# EAGLE schematic raceCapture (EAGLE 5.09)

## Sheet 1 of 5
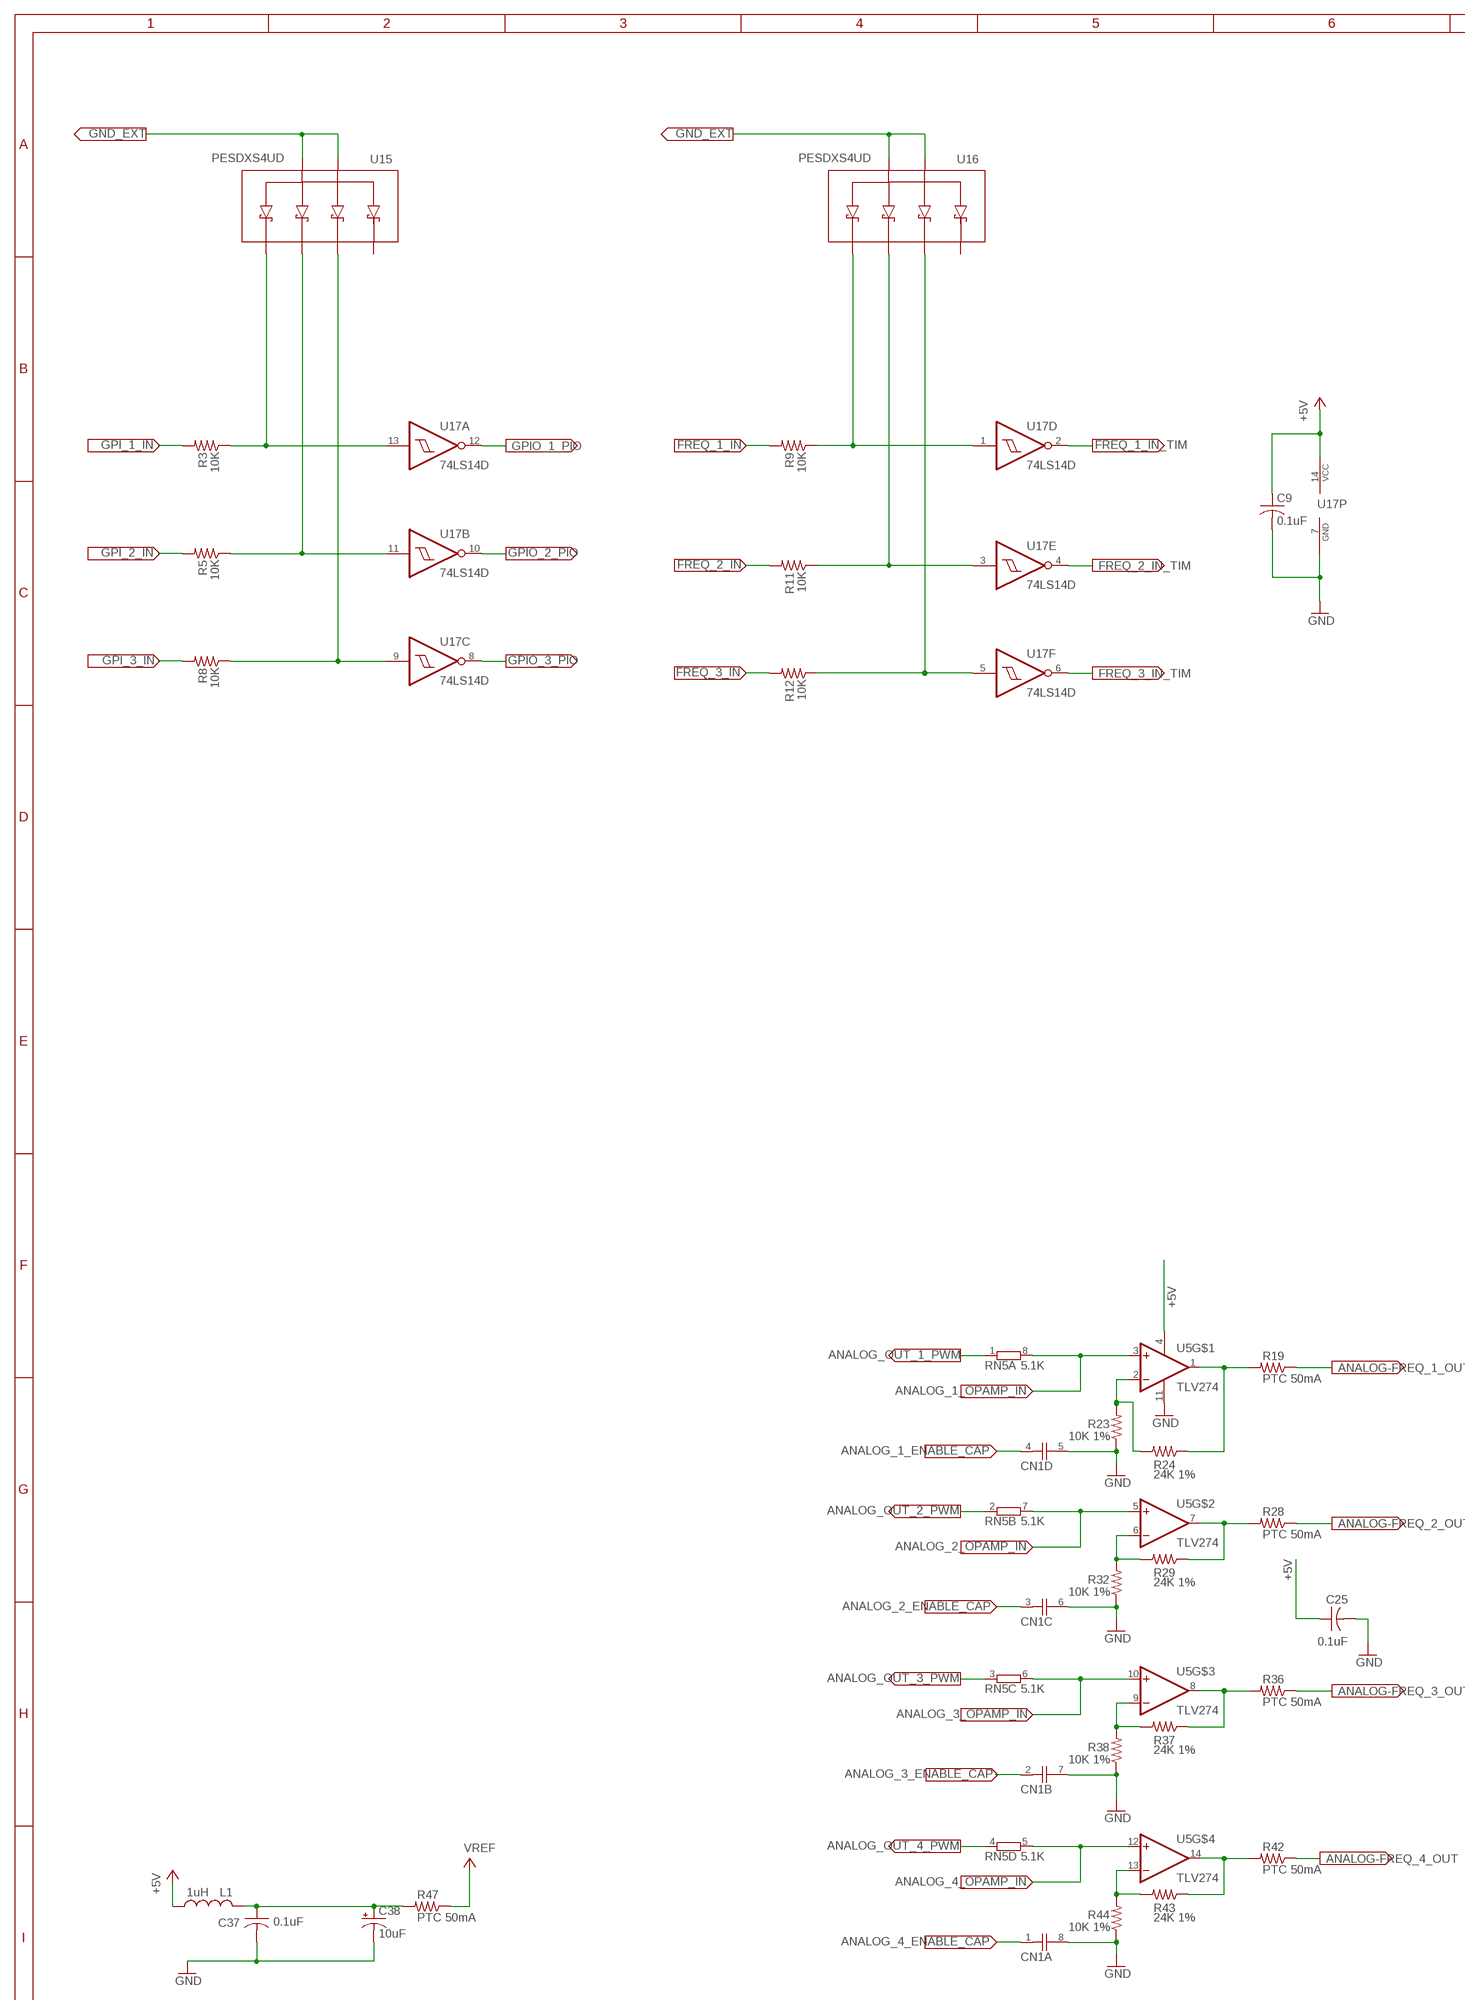
[diagram p0: schematic, sheet 1, part 1 of 2]
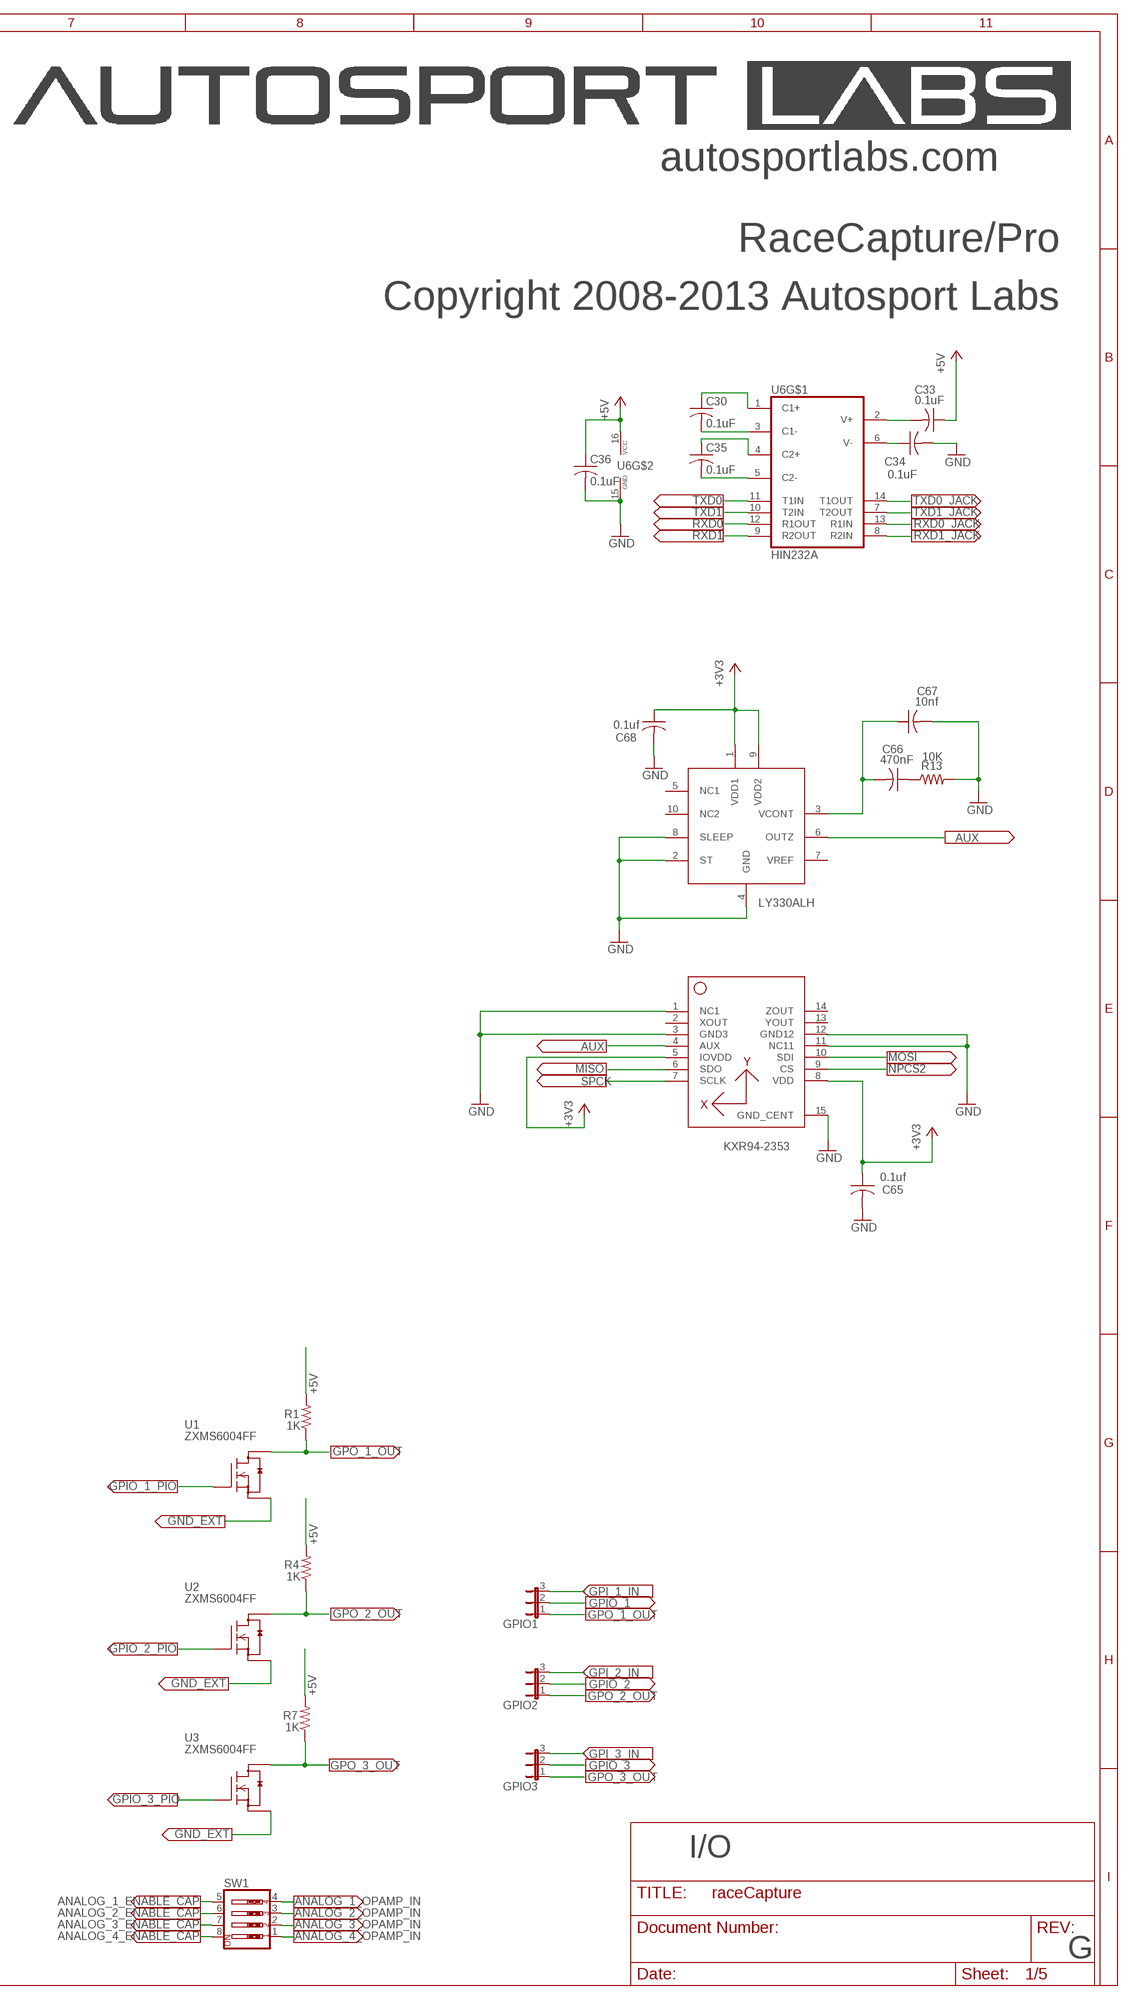
[diagram p1: schematic, sheet 1, part 2 of 2]

### Parts
C9  0.1uF  C-USC0603  [C0603]
C25  0.1uF  C-USC0603  [C0603]
C30  0.1uF  C-USC0603  [C0603]
C33  0.1uF  C-USC0603  [C0603]
C34  0.1uF  C-USC0603  [C0603]
C35  0.1uF  C-USC0603  [C0603]
C36  0.1uF  C-USC0603  [C0603]
C37  0.1uF  C-USC0603  [C0603]
C38  10uF  CPOL-USSMCA  [SMC_A]
C65  0.1uf  C-USC0603K  [C0603K]
C66  470nF  C-USC0603K  [C0603K]
C67  10nf  C-USC0603K  [C0603K]
C68  0.1uf  C-USC0603K  [C0603K]
CN1  CAP_ARRAY_41206_ARRAY  [1206_ARRAY]
GPIO1  JP2E  [JP2]
GPIO2  JP2E  [JP2]
GPIO3  JP2E  [JP2]
L1  1uH  INDUCTOR  [1210]
R1  1K  R-US_R1206  [R1206]
R3  10K  R-US_R1206  [R1206]
R4  1K  R-US_R1206  [R1206]
R5  10K  R-US_R1206  [R1206]
R7  1K  R-US_R1206  [R1206]
R8  10K  R-US_R1206  [R1206]
R9  10K  R-US_R1206  [R1206]
R11  10K  R-US_R1206  [R1206]
R12  10K  R-US_R1206  [R1206]
R13  10K  R-US_R0603  [R0603]
R19  PTC 50mA  R-US_R1206  [R1206]
R23  10K 1%  R-US_R0603  [R0603]
R24  24K 1%  R-US_R0603  [R0603]
R28  PTC 50mA  R-US_R1206  [R1206]
R29  24K 1%  R-US_R0603  [R0603]
R32  10K 1%  R-US_R0603  [R0603]
R36  PTC 50mA  R-US_R1206  [R1206]
R37  24K 1%  R-US_R0603  [R0603]
R38  10K 1%  R-US_R0603  [R0603]
R42  PTC 50mA  R-US_R1206  [R1206]
R43  24K 1%  R-US_R0603  [R0603]
R44  10K 1%  R-US_R0603  [R0603]
R47  PTC 50mA  R-US_R1206  [R1206]
RN5  5.1K  4R-N0603-ARC  [0603-ARC]
SW1  SW_DIP-4  [EDG-04]
U1  ZXMS6004FF  [SOT-23]
U2  ZXMS6004FF  [SOT-23]
U3  ZXMS6004FF  [SOT-23]
U4  KXR94-2353  KXR94  [5X5_DFN]
U5  TLV274  TLV274SO14  [SO14]
U6  HIN232A  [SOIC-16]
U10  LY330ALH  [LGA-10]
U15  PESDXS4UD  [SC-74]
U16  PESDXS4UD  [SC-74]
U17  74LS14D  [SO14]

### Nets
+3.3V: U4.5(IOVDD) ; supply symbol labelled +3V3
+5V: C9.1 C25.1 C33.1 C36.1 L1.1 R1.2 R4.2 R7.2 U5.4(V+) U6.16(VCC) U17.14(P:VCC) ; also sheet 2,3,4,5
ANALOG-FREQ_1_OPAMP_OUT: R19.2 R24.1 U5.1(OUT)
ANALOG-FREQ_1_OUT: R19.1 ; also sheet 5
ANALOG-FREQ_2_OPAMP_OUT: R28.2 R29.1 U5.7(OUT)
ANALOG-FREQ_2_OUT: R28.1 ; also sheet 5
ANALOG-FREQ_3_OPAMP_OUT: R36.2 R37.1 U5.8(OUT)
ANALOG-FREQ_3_OUT: R36.1 ; also sheet 5
ANALOG-FREQ_4_OPAMP_OUT: R42.2 R43.1 U5.14(OUT)
ANALOG-FREQ_4_OUT: R42.1 ; also sheet 5
ANALOG_1_ENABLE_CAP: CN1.4 SW1.5
ANALOG_1_OPAMP_IN: RN5.8 SW1.4 U5.3(+IN)
ANALOG_2_ENABLE_CAP: CN1.3 SW1.6
ANALOG_2_OPAMP_IN: RN5.7 SW1.3 U5.5(+IN)
ANALOG_3_ENABLE_CAP: CN1.2 SW1.7
ANALOG_3_OPAMP_IN: RN5.6 SW1.2 U5.10(+IN)
ANALOG_4_ENABLE_CAP: CN1.1 SW1.8
ANALOG_4_OPAMP_IN: RN5.5 SW1.1 U5.12(+IN)
ANALOG_OUT_1_PWM: RN5.1 ; also sheet 3
ANALOG_OUT_2_PWM: RN5.2 ; also sheet 3
ANALOG_OUT_3_PWM: RN5.3 ; also sheet 3
ANALOG_OUT_4_PWM: RN5.4 ; also sheet 3
AUX: U4.4(AUX) U10.6(OUTZ)
FREQ_1_IN: R9.2 ; also sheet 5
FREQ_1_IN_TIM: U17.2(D:O) ; also sheet 3
FREQ_2_IN: R11.2 ; also sheet 5
FREQ_2_IN_TIM: U17.4(E:O) ; also sheet 3
FREQ_3_IN: R12.2 ; also sheet 5
FREQ_3_IN_TIM: U17.6(F:O) ; also sheet 3
GND: C9.2 C25.2 C34.2 C36.2 C37.2 C38.- C65.2 C67.2 C68.2 CN1.5 CN1.6 CN1.7 CN1.8 R13.2 R23.1 R32.1 R38.1 R44.1 U4.1(NC1) U4.3(GND3) U4.11(NC11) U4.12(GND12) U4.15(GND_CENT) U5.11(V-) U6.15(GND) U10.2(ST) U10.4(GND) U10.8(SLEEP) U17.7(P:GND) ; also sheet 2,3,4,5
GND_EXT: U1.2(S1) U2.2(S1) U3.2(S1) U15.2 U15.5 U16.2 U16.5 ; also sheet 2,5
GPI_1_IN: GPIO1.3 R3.2
GPI_2_IN: GPIO2.3 R5.2
GPI_3_IN: GPIO3.3 R8.2
GPIO_1: GPIO1.2 ; also sheet 5
GPIO_1_PIO: U1.1(G) U17.12(A:O) ; also sheet 3
GPIO_2: GPIO2.2 ; also sheet 5
GPIO_2_PIO: U2.1(G) U17.10(B:O) ; also sheet 3
GPIO_3: GPIO3.2 ; also sheet 5
GPIO_3_PIO: U3.1(G) U17.8(C:O) ; also sheet 3
GPO_1_OUT: GPIO1.1 R1.1 U1.3(D1)
GPO_2_OUT: GPIO2.1 R4.1 U2.3(D1)
GPO_3_OUT: GPIO3.1 R7.1 U3.3(D1)
MISO: U4.6(SDO) ; also sheet 3,5
MOSI: U4.10(SDI) ; also sheet 3,5
N$1: C66.1 R13.1
N$3: C66.2 C67.1 U10.3(VCONT)
N$5: R3.1 U15.6 U17.13(A:I)
N$8: R29.2 R32.2 U5.6(-IN)
N$10: R23.2 R24.2 U5.2(-IN)
N$12: R37.2 R38.2 U5.9(-IN)
N$13: R5.1 U15.4 U17.11(B:I)
N$14: R43.2 R44.2 U5.13(-IN)
N$15: R8.1 U15.3 U17.9(C:I)
N$16: C30.1 U6.1(C1+)
N$17: C30.2 U6.3(C1-)
N$18: C35.1 U6.4(C2+)
N$19: C35.2 U6.5(C2-)
N$20: C33.2 U6.2(V+)
N$21: C34.1 U6.6(V-)
N$25: R9.1 U16.6 U17.1(D:I)
N$26: R11.1 U16.4 U17.3(E:I)
N$29: R12.1 U16.3 U17.5(F:I)
NPCS2: U4.9(CS) ; also sheet 3
RXD0: U6.12(R1OUT) ; also sheet 3
RXD0_JACK: U6.13(R1IN) ; also sheet 5
RXD1: U6.9(R2OUT) ; also sheet 3
RXD1_JACK: U6.8(R2IN) ; also sheet 5
SPCK: U4.7(SCLK) ; also sheet 3,5
TXD0: U6.11(T1IN) ; also sheet 3
TXD0_JACK: U6.14(T1OUT) ; also sheet 5
TXD1: U6.10(T2IN) ; also sheet 3
TXD1_JACK: U6.7(T2OUT) ; also sheet 5
V+: C65.1 C68.1 U4.8(VDD) U10.1(VDD1) U10.9(VDD2) ; supply symbol labelled +3V3 ; also sheet 3,5
VREF: R47.1 ; also sheet 5
VREF_PROTECT: C37.1 C38.+ L1.2 R47.2
Unconnected: U4.2(XOUT) U4.13(YOUT) U4.14(ZOUT) U10.5(NC1) U10.7(VREF) U10.10(NC2) U15.1 U16.1

### Notes on the sheet
- autosportlabs.com
- RaceCapture/Pro
- Copyright 2008-2013 Autosport Labs
- LY330ALH
- KXR94-2353
- I/O
- G

## Sheet 2 of 5
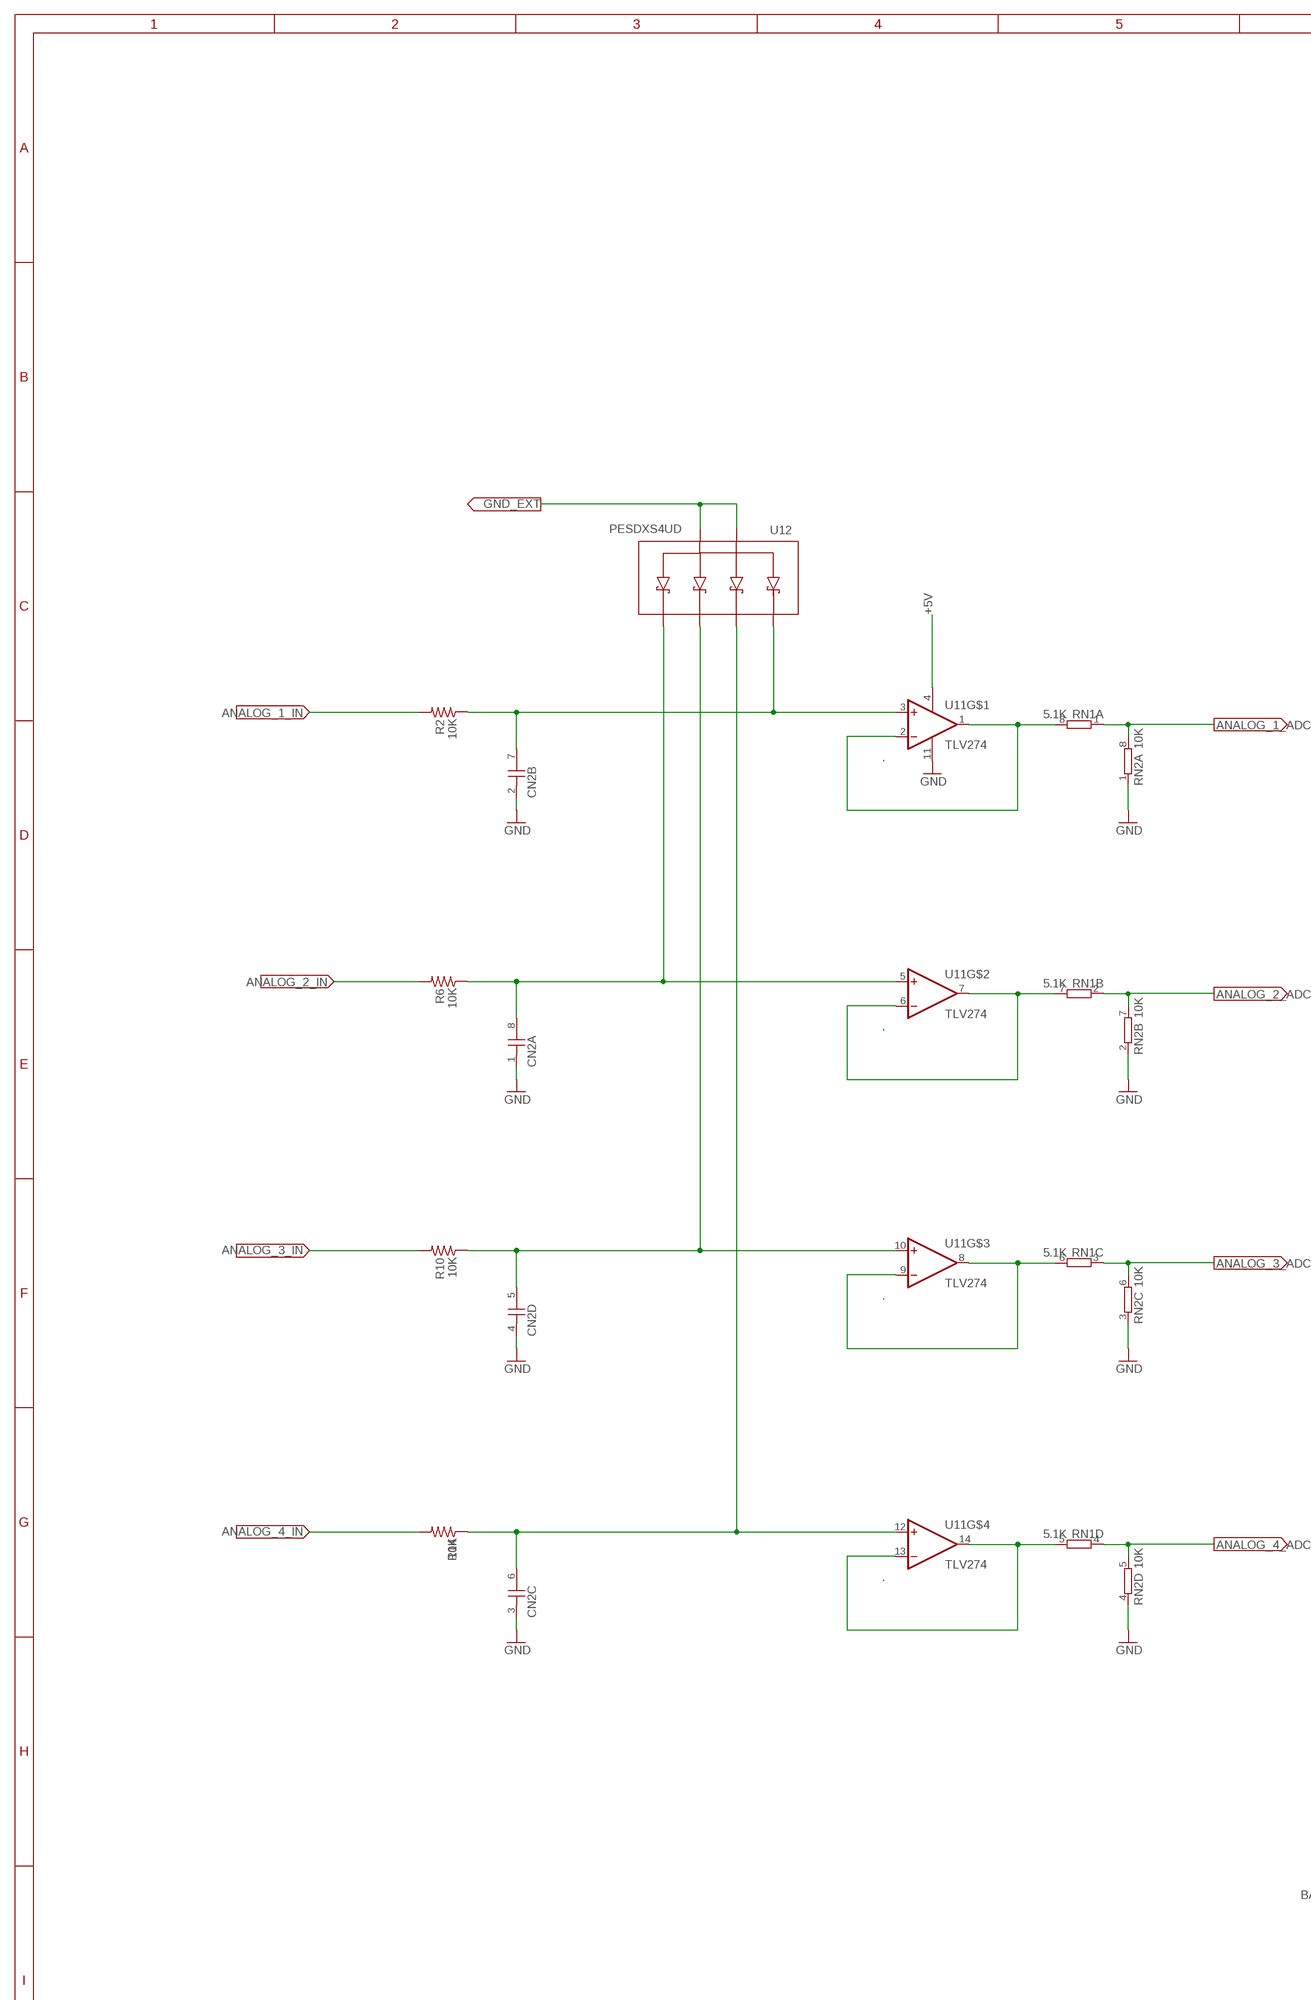
[diagram p2: schematic, sheet 2, part 1 of 2]
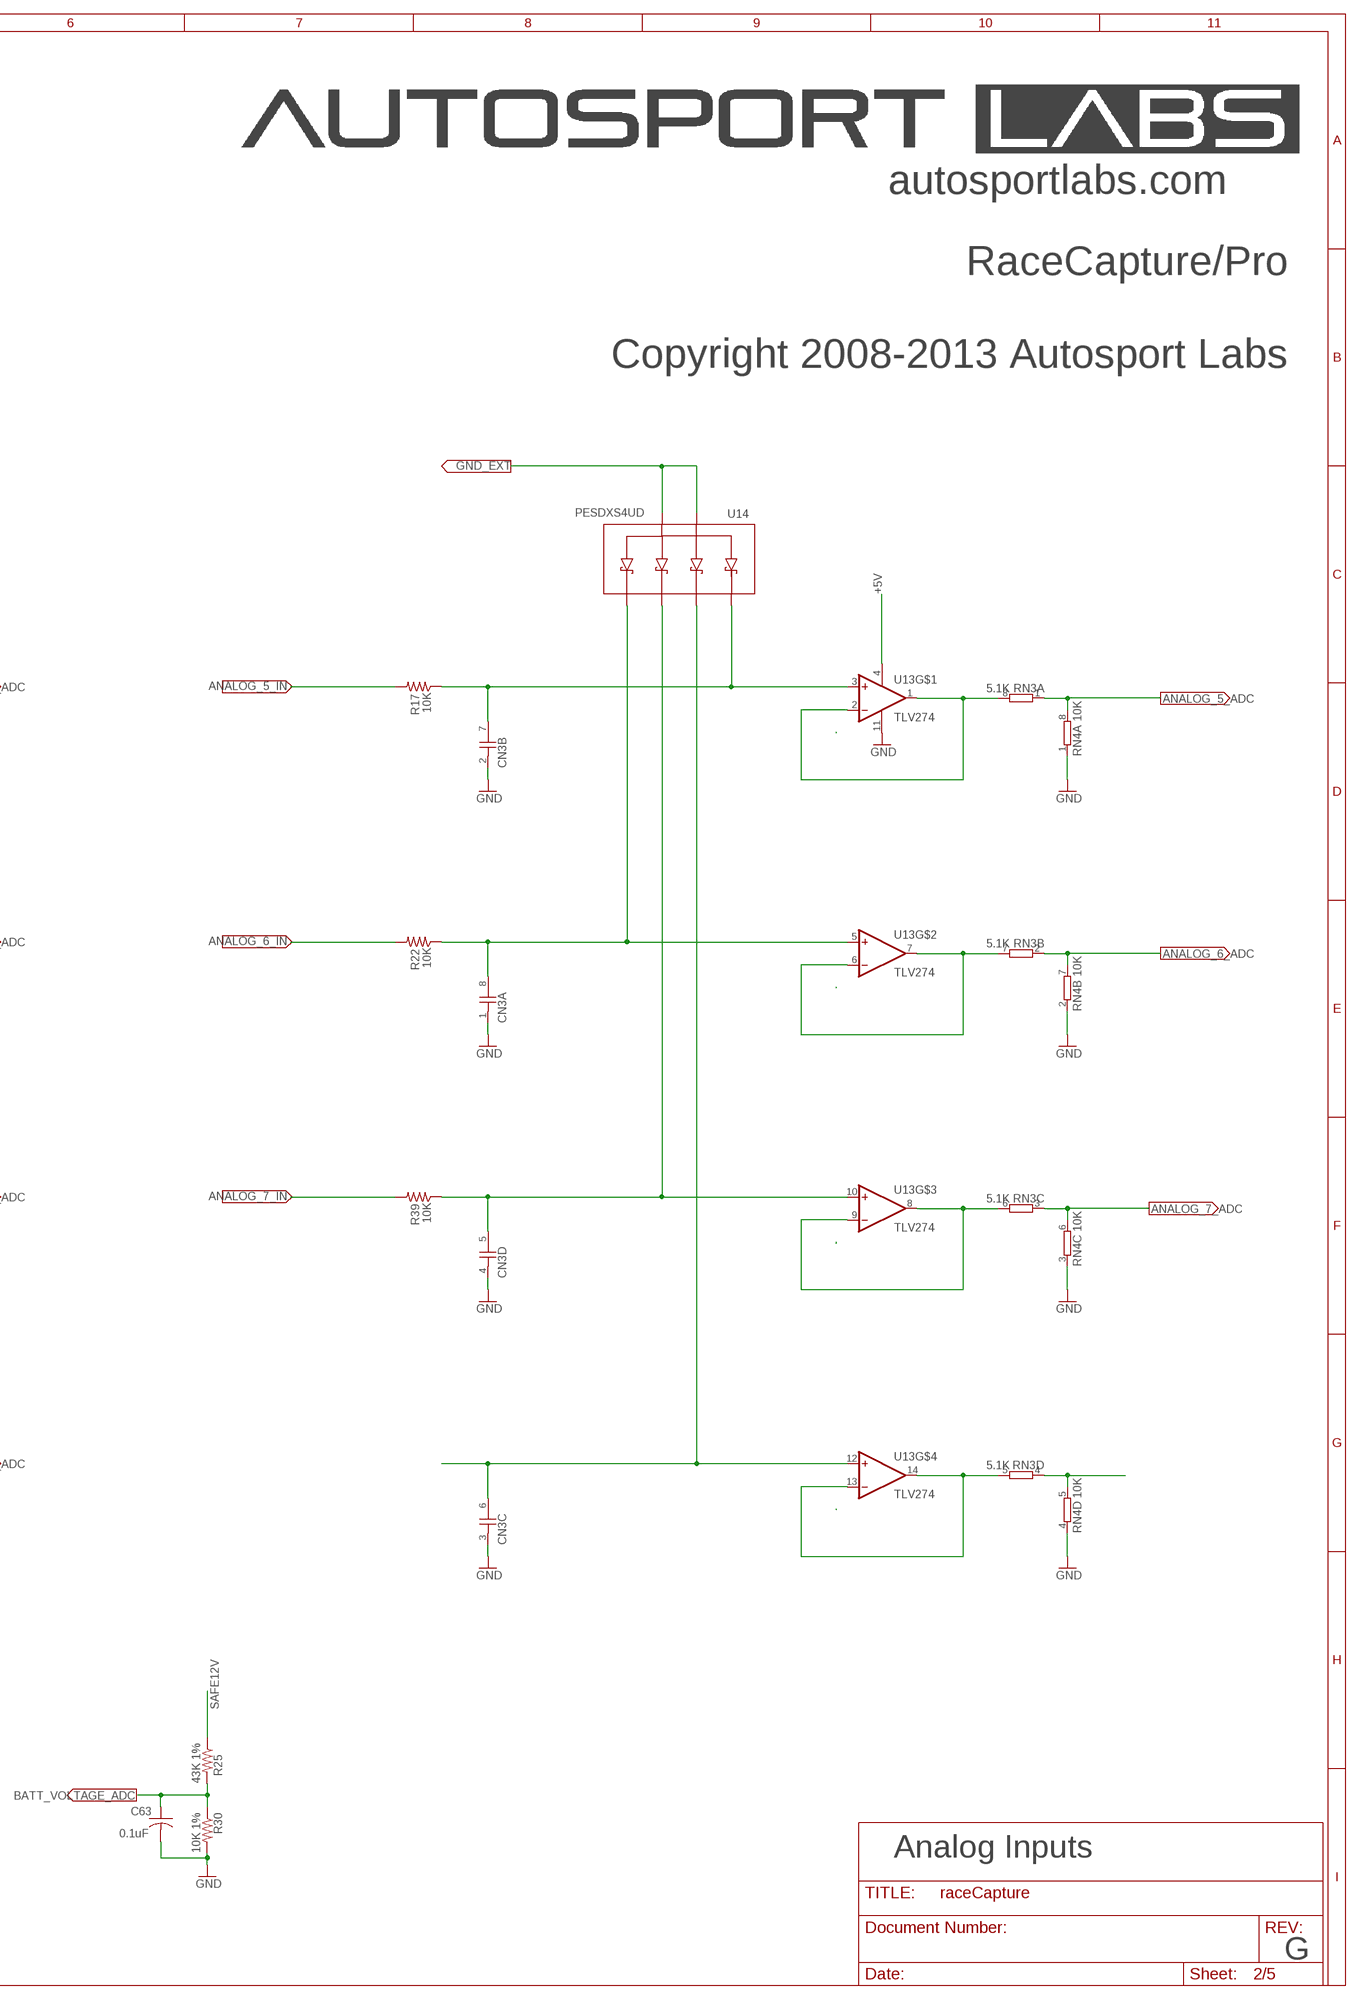
[diagram p3: schematic, sheet 2, part 2 of 2]

### Parts
C63  0.1uF  C-USC0603  [C0603]
CN2  CAP_ARRAY_41206_ARRAY  [1206_ARRAY]
CN3  CAP_ARRAY_41206_ARRAY  [1206_ARRAY]
R2  10K  R-US_R1206  [R1206]
R6  10K  R-US_R1206  [R1206]
R10  10K  R-US_R1206  [R1206]
R14  10K  R-US_R1206  [R1206]
R17  10K  R-US_R1206  [R1206]
R22  10K  R-US_R1206  [R1206]
R25  43K 1%  R-US_R0603  [R0603]
R30  10K 1%  R-US_R0603  [R0603]
R39  10K  R-US_R1206  [R1206]
RN1  5.1K  4R-N0603-ARC  [0603-ARC]
RN2  10K  4R-N0603-ARC  [0603-ARC]
RN3  5.1K  4R-N0603-ARC  [0603-ARC]
RN4  10K  4R-N0603-ARC  [0603-ARC]
U11  TLV274  TLV274SO14  [SO14]
U12  PESDXS4UD  [SC-74]
U13  TLV274  TLV274SO14  [SO14]
U14  PESDXS4UD  [SC-74]

### Nets
+5V: U11.4(V+) U13.4(V+) ; also sheet 1,3,4,5
ANALOG-FREQ_1_OPAMP_OUT1: RN1.8 U11.1(OUT) U11.2(-IN)
ANALOG-FREQ_1_OPAMP_OUT2: RN1.7 U11.6(-IN) U11.7(OUT)
ANALOG-FREQ_1_OPAMP_OUT3: RN1.6 U11.8(OUT) U11.9(-IN)
ANALOG-FREQ_1_OPAMP_OUT4: RN1.5 U11.13(-IN) U11.14(OUT)
ANALOG-FREQ_1_OPAMP_OUT5: RN3.8 U13.1(OUT) U13.2(-IN)
ANALOG-FREQ_1_OPAMP_OUT6: RN3.7 U13.6(-IN) U13.7(OUT)
ANALOG-FREQ_1_OPAMP_OUT7: RN3.6 U13.8(OUT) U13.9(-IN)
ANALOG-FREQ_1_OPAMP_OUT8: RN3.5 U13.13(-IN) U13.14(OUT)
ANALOG_1_ADC: RN1.1 RN2.8 ; also sheet 3
ANALOG_1_IN: R2.2 ; also sheet 5
ANALOG_2_ADC: RN1.2 RN2.7 ; also sheet 3
ANALOG_2_IN: R6.2 ; also sheet 5
ANALOG_3_ADC: RN1.3 RN2.6 ; also sheet 3
ANALOG_3_IN: R10.2 ; also sheet 5
ANALOG_4_ADC: RN1.4 RN2.5 ; also sheet 3
ANALOG_4_IN: R14.2 ; also sheet 5
ANALOG_5_ADC: RN3.1 RN4.8 ; also sheet 3
ANALOG_5_IN: R17.2 ; also sheet 5
ANALOG_6_ADC: RN3.2 RN4.7 ; also sheet 3
ANALOG_6_IN: R22.2 ; also sheet 5
ANALOG_7_ADC: RN3.3 RN4.6 ; also sheet 3
ANALOG_7_IN: R39.2 ; also sheet 5
ANALOG_8_ADC: RN3.4 RN4.5
BATT_VOLTAGE_ADC: C63.1 R25.2 R30.1 ; also sheet 3
GND: C63.2 CN2.1 CN2.2 CN2.3 CN2.4 CN3.1 CN3.2 CN3.3 CN3.4 R30.2 RN2.1 RN2.2 RN2.3 RN2.4 RN4.1 RN4.2 RN4.3 RN4.4 U11.11(V-) U13.11(V-) ; also sheet 1,3,4,5
GND_EXT: U12.2 U12.5 U14.2 U14.5 ; also sheet 1,5
N$11: CN2.7 R2.1 U11.3(+IN) U12.1
N$24: CN2.8 R6.1 U11.5(+IN) U12.6
N$28: CN2.5 R10.1 U11.10(+IN) U12.4
N$32: CN2.6 R14.1 U11.12(+IN) U12.3
N$36: CN3.7 R17.1 U13.3(+IN) U14.1
N$41: CN3.8 R22.1 U13.5(+IN) U14.6
N$45: CN3.5 R39.1 U13.10(+IN) U14.4
N$49: CN3.6 U13.12(+IN) U14.3
SAFE12V: R25.1 ; also sheet 4

### Notes on the sheet
- autosportlabs.com
- RaceCapture/Pro
- Copyright 2008-2013 Autosport Labs
- Analog Inputs
- G

## Sheet 3 of 5
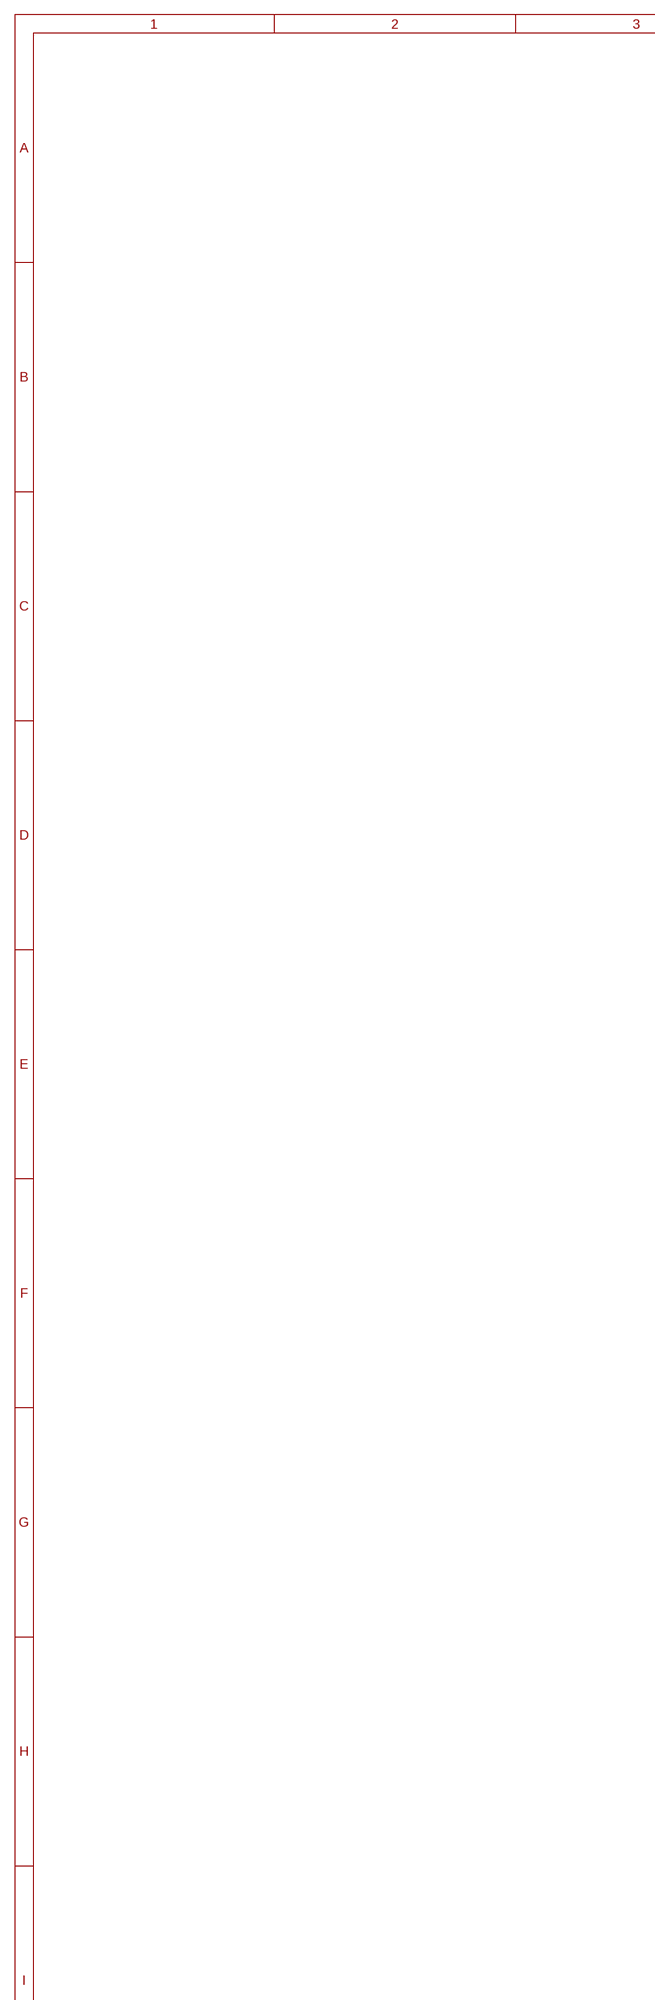
[diagram p4: schematic, sheet 3, part 1 of 2]
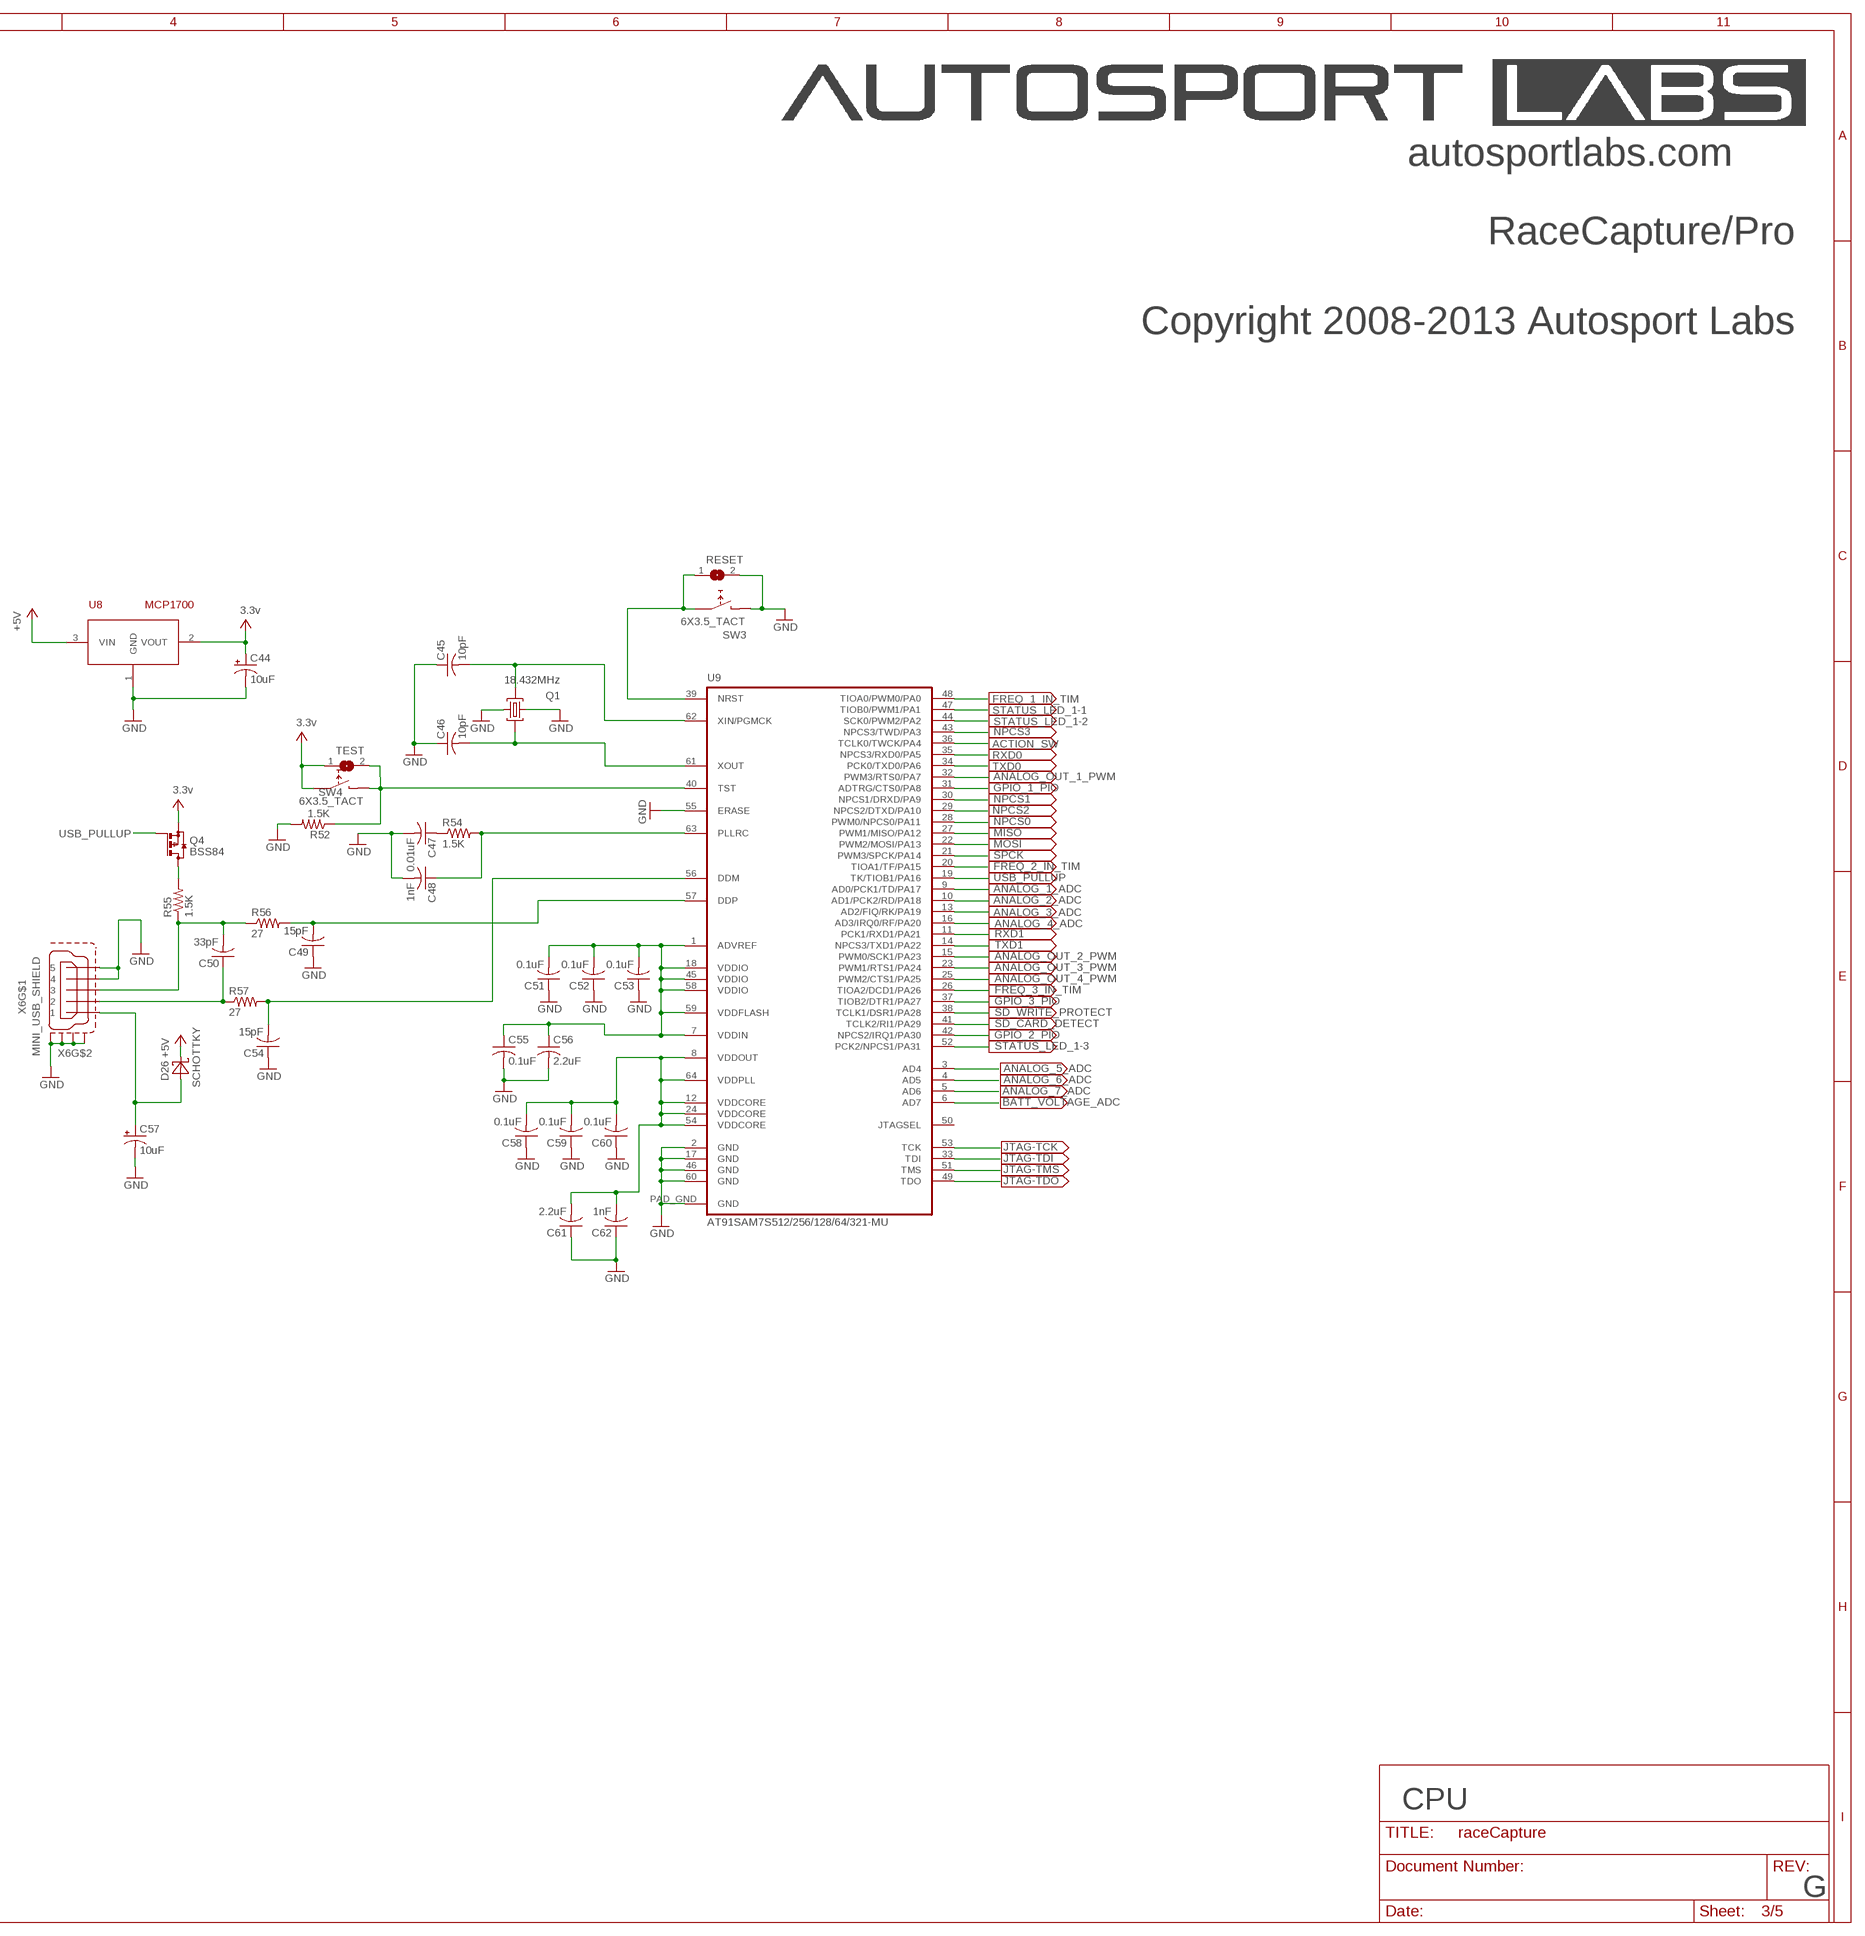
[diagram p5: schematic, sheet 3, part 2 of 2]

### Parts
C44  10uF  CPOL-USSMCA  [SMC_A]
C45  10pF  C-USC0603  [C0603]
C46  10pF  C-USC0603  [C0603]
C47  0.01uF  C-USC0603  [C0603]
C48  1nF  C-USC0603  [C0603]
C49  15pF  C-USC0603  [C0603]
C50  33pF  C-USC0603  [C0603]
C51  0.1uF  C-USC0603  [C0603]
C52  0.1uF  C-USC0603  [C0603]
C53  0.1uF  C-USC0603  [C0603]
C54  15pF  C-USC0603  [C0603]
C55  0.1uF  C-USC0603  [C0603]
C56  2.2uF  C-USC0603  [C0603]
C57  10uF  CPOL-USSMCA  [SMC_A]
C58  0.1uF  C-USC0603  [C0603]
C59  0.1uF  C-USC0603  [C0603]
C60  0.1uF  C-USC0603  [C0603]
C61  2.2uF  C-USC0603  [C0603]
C62  1nF  C-USC0603  [C0603]
D26  SCHOTTKY  [SMA]
Q1  18.432MHz  ABM8X2  [5X3.2]
Q4  BSS84  [SOT23]
R52  1.5K  R-US_R0603  [R0603]
R54  1.5K  R-US_R0603  [R0603]
R55  1.5K  R-US_R0603  [R0603]
R56  27  R-US_R0603  [R0603]
R57  27  R-US_R0603  [R0603]
RESET  SJ  [SJ]
SW3  6X3.5_TACT  [TACT_6X3.5]
SW4  6X3.5_TACT  [TACT_6X3.5]
TEST  SJ  [SJ]
U8  MCP1700  [SOT-23]
U9  AT91SAM7S512/256/128/64/321-MU  [QFN64]
X6  MINI_USB_SHIELD  [MINI-USB_JACK]

### Nets
+5V: D26.C U8.3(VIN) ; also sheet 1,2,4,5
ACTION_SW: U9.36(TCLK0/TWCK/PA4) ; also sheet 5
ANALOG_1_ADC: U9.9(AD0/PCK1/TD/PA17) ; also sheet 2
ANALOG_2_ADC: U9.10(AD1/PCK2/RD/PA18) ; also sheet 2
ANALOG_3_ADC: U9.13(AD2/FIQ/RK/PA19) ; also sheet 2
ANALOG_4_ADC: U9.16(AD3/IRQ0/RF/PA20) ; also sheet 2
ANALOG_5_ADC: U9.3(AD4) ; also sheet 2
ANALOG_6_ADC: U9.4(AD5) ; also sheet 2
ANALOG_7_ADC: U9.5(AD6) ; also sheet 2
ANALOG_OUT_1_PWM: U9.32(PWM3/RTS0/PA7) ; also sheet 1
ANALOG_OUT_2_PWM: U9.15(PWM0/SCK1/PA23) ; also sheet 1
ANALOG_OUT_3_PWM: U9.23(PWM1/RTS1/PA24) ; also sheet 1
ANALOG_OUT_4_PWM: U9.25(PWM2/CTS1/PA25) ; also sheet 1
BATT_VOLTAGE_ADC: U9.6(AD7) ; also sheet 2
DDM: C54.2 R57.2 U9.56(DDM)
DDP: C49.2 R56.2 U9.57(DDP)
FREQ_1_IN_TIM: U9.48(TIOA0/PWM0/PA0) ; also sheet 1
FREQ_2_IN_TIM: U9.20(TIOA1/TF/PA15) ; also sheet 1
FREQ_3_IN_TIM: U9.26(TIOA2/DCD1/PA26) ; also sheet 1
GND: C44.- C45.1 C46.1 C47.2 C48.2 C49.1 C51.1 C52.1 C53.1 C54.1 C55.2 C56.2 C57.- C58.1 C59.1 C60.1 C61.1 C62.1 Q1.2(CRYSTAL1) Q1.4(CRYSTAL2) R52.2 RESET.2 SW3.P$2 U8.1(GND) U9.2(GND) U9.17(GND) U9.46(GND) U9.55(ERASE) U9.60(GND) U9.PAD_GND(GND) X6.4 X6.5 X6.M1(S1) X6.M2(S2) X6.M3(S3) X6.M4(S4) ; also sheet 1,2,4,5
GPIO_1_PIO: U9.31(ADTRG/CTS0/PA8) ; also sheet 1
GPIO_2_PIO: U9.42(NPCS2/IRQ1/PA30) ; also sheet 1
GPIO_3_PIO: U9.37(TIOB2/DTR1/PA27) ; also sheet 1
JTAG-TCK: U9.53(TCK) ; also sheet 5
JTAG-TDI: U9.33(TDI) ; also sheet 5
JTAG-TDO: U9.49(TDO) ; also sheet 5
JTAG-TMS: U9.51(TMS) ; also sheet 5
MISO: U9.27(PWM1/MISO/PA12) ; also sheet 1,5
MOSI: U9.22(PWM2/MOSI/PA13) ; also sheet 1,5
N$4: Q4.3(D) R55.2
N$40: C47.1 R54.1
N$100: R52.1 SW4.P$2 TEST.2 U9.40(TST)
N$300: C50.2 R55.1 R56.1 X6.3
N$400: C50.1 R57.1 X6.2
NPCS0: U9.28(PWM0/NPCS0/PA11) ; also sheet 5
NPCS1: U9.30(NPCS1/DRXD/PA9) ; also sheet 5
NPCS2: U9.29(NPCS2/DTXD/PA10) ; also sheet 1
NPCS3: U9.43(NPCS3/TWD/PA3)
PLLRC: C48.1 R54.2 U9.63(PLLRC)
RESET: RESET.1 SW3.P$1 U9.39(NRST) ; also sheet 5
RXD0: U9.35(NPCS3/RXD0/PA5) ; also sheet 1
RXD1: U9.11(PCK1/RXD1/PA21) ; also sheet 1
SD_CARD_DETECT: U9.41(TCLK2/RI1/PA29) ; also sheet 5
SD_WRITE_PROTECT: U9.38(TCLK1/DSR1/PA28) ; also sheet 5
SPCK: U9.21(PWM3/SPCK/PA14) ; also sheet 1,5
STATUS_LED_1-1: U9.47(TIOB0/PWM1/PA1) ; also sheet 5
STATUS_LED_1-2: U9.44(SCK0/PWM2/PA2) ; also sheet 5
STATUS_LED_1-3: U9.52(PCK2/NPCS1/PA31) ; also sheet 5
TXD0: U9.34(PCK0/TXD0/PA6) ; also sheet 1
TXD1: U9.14(NPCS3/TXD1/PA22) ; also sheet 1
USB_PULLUP: Q4.1(G) U9.19(TK/TIOB1/PA16)
V+: C44.+ C51.2 C52.2 C53.2 C55.1 C56.1 Q4.2(S) SW4.P$1 TEST.1 U8.2(VOUT) U9.1(ADVREF) U9.7(VDDIN) U9.18(VDDIO) U9.45(VDDIO) U9.58(VDDIO) U9.59(VDDFLASH) ; supply symbol labelled 3.3v ; also sheet 1,5
VBUS: C57.+ D26.A X6.1
VDDOUT: C58.2 C59.2 C60.2 C61.2 C62.2 U9.8(VDDOUT) U9.12(VDDCORE) U9.24(VDDCORE) U9.54(VDDCORE) U9.64(VDDPLL)
XIN1: C46.2 Q1.1(GND1) U9.61(XOUT)
XOUT1: C45.2 Q1.3(GND2) U9.62(XIN/PGMCK)
Unconnected: U9.50(JTAGSEL)

### Notes on the sheet
- autosportlabs.com
- RaceCapture/Pro
- Copyright 2008-2013 Autosport Labs
- CPU
- G

## Sheet 4 of 5
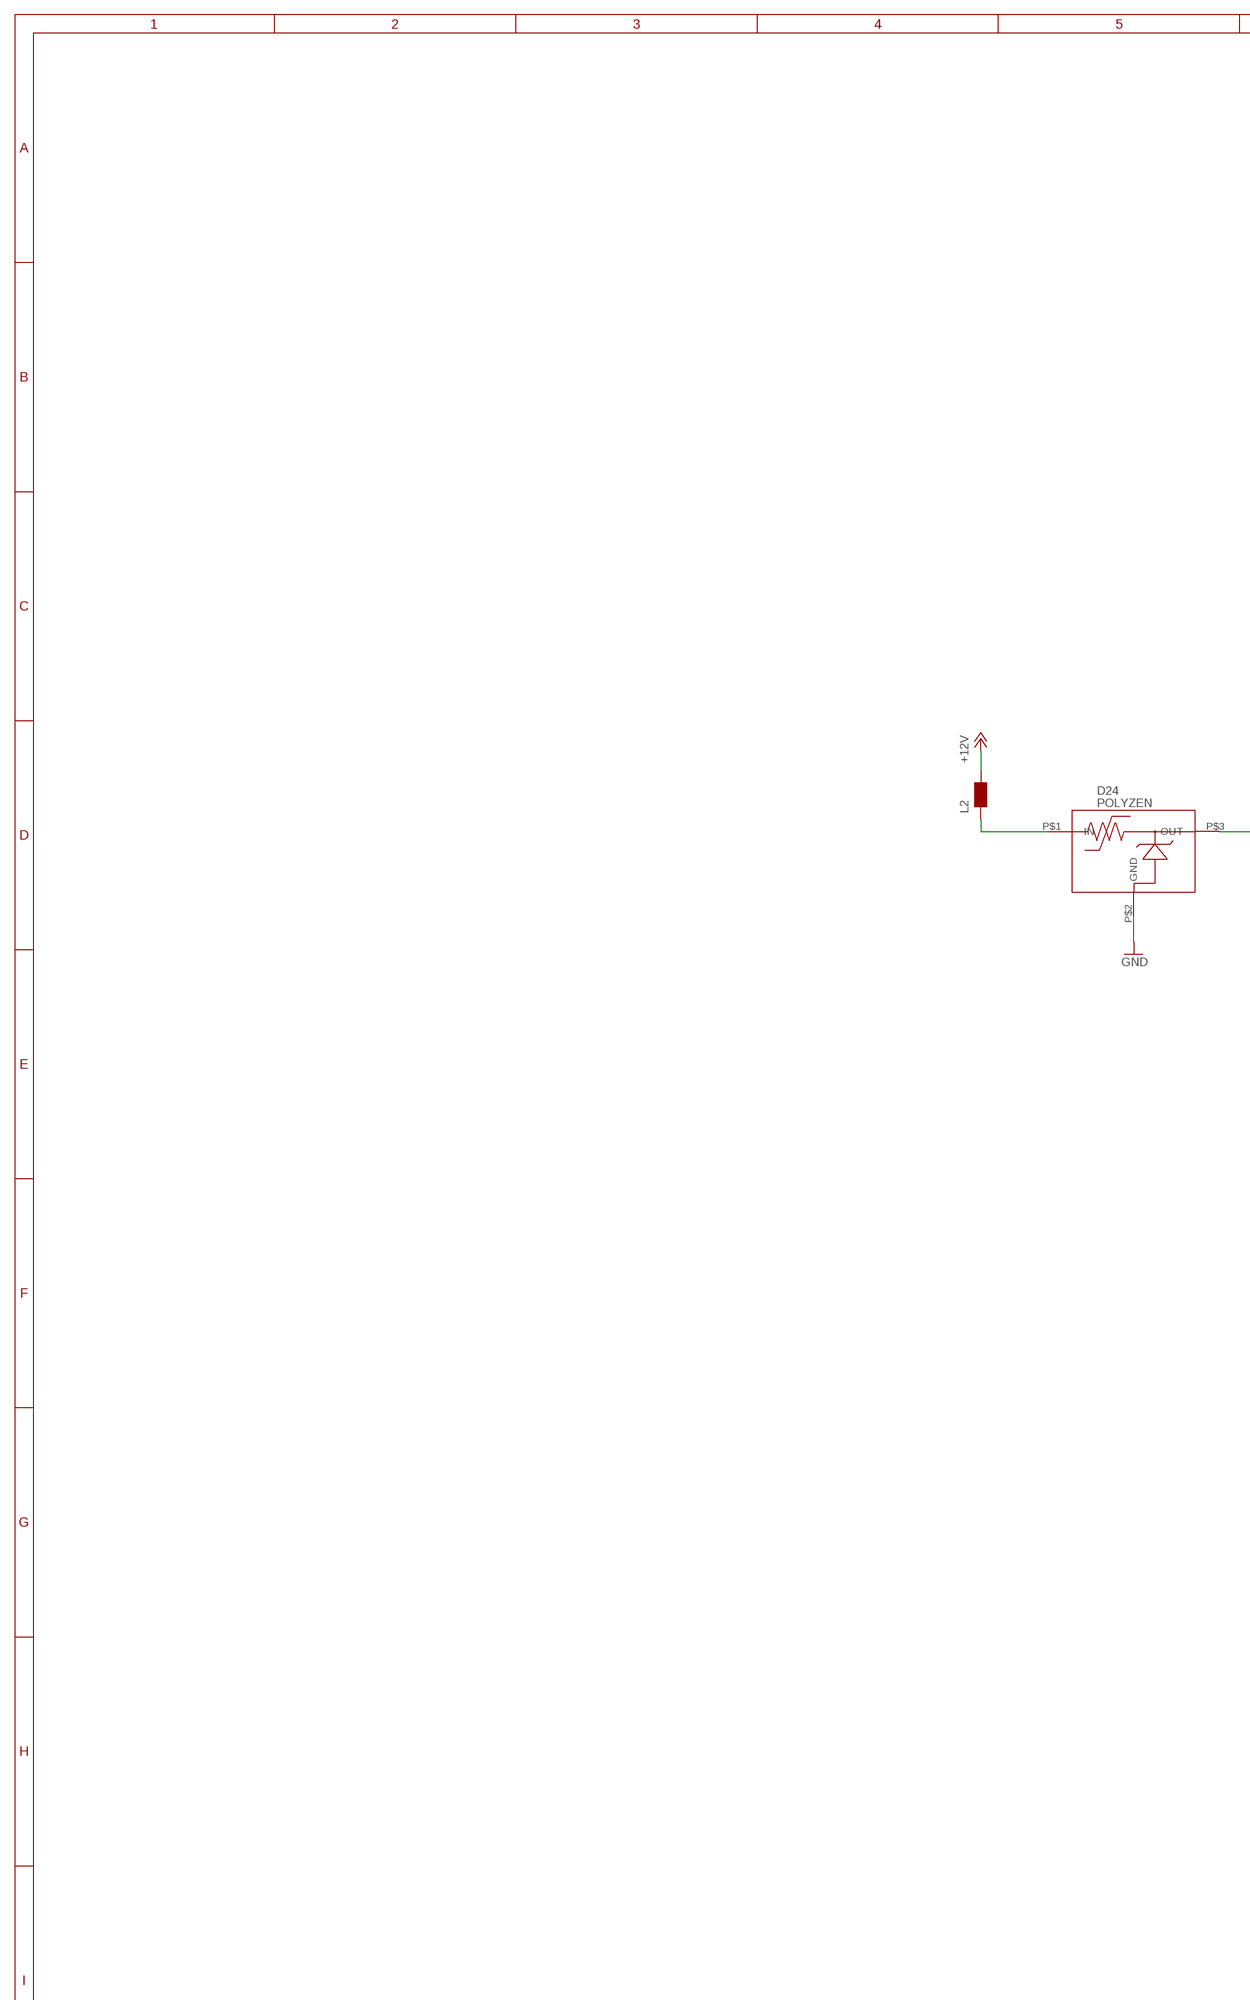
[diagram p6: schematic, sheet 4, part 1 of 2]
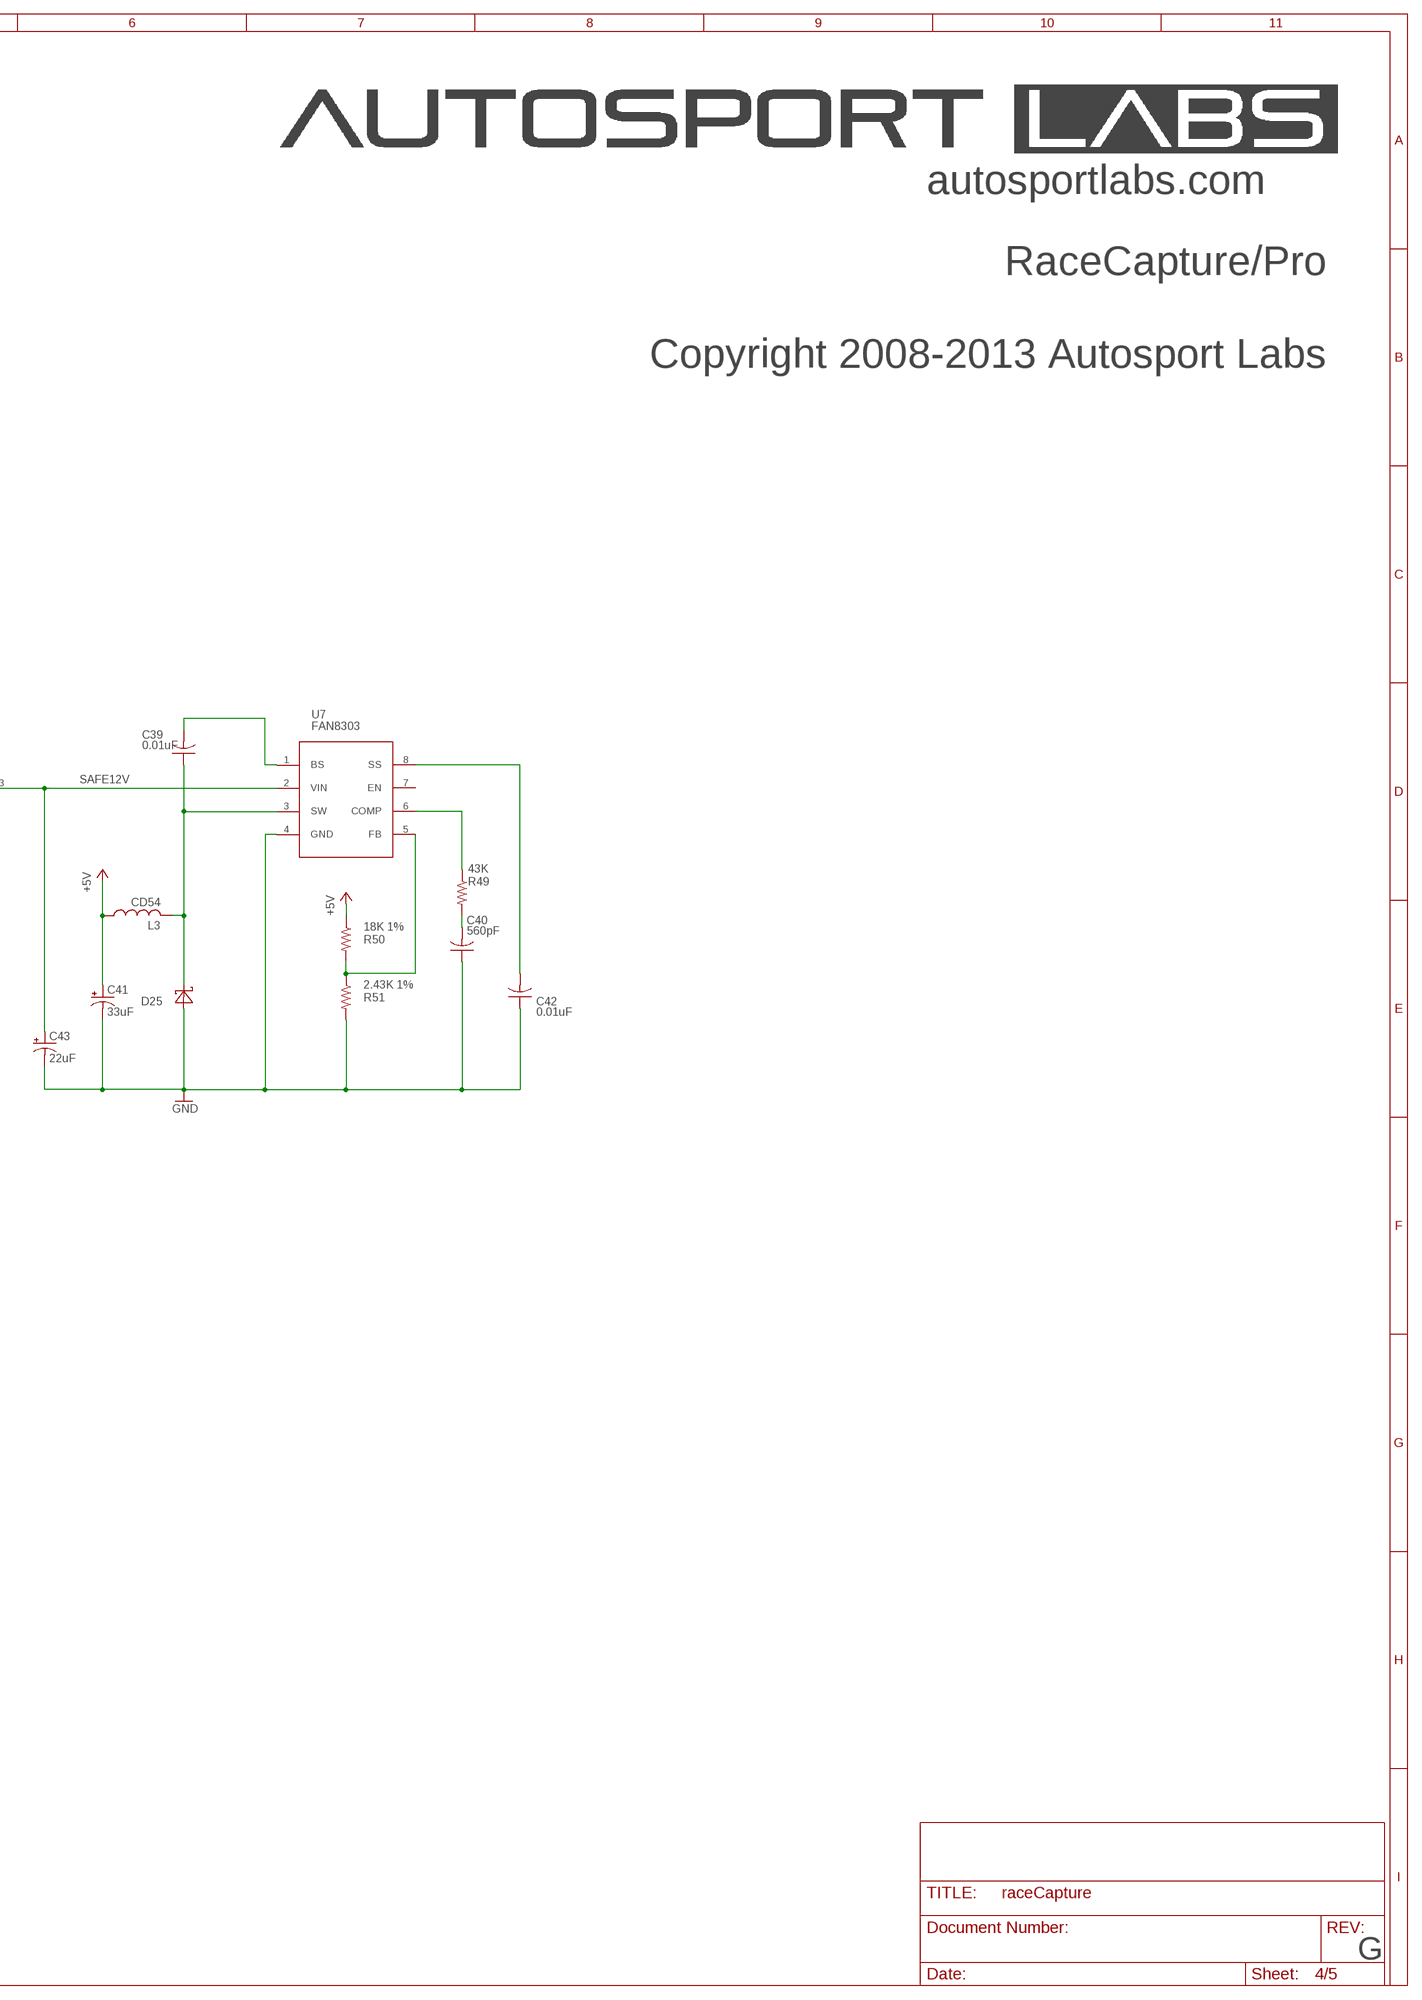
[diagram p7: schematic, sheet 4, part 2 of 2]

### Parts
C39  0.01uF  C-USC0603  [C0603]
C40  560pF  C-USC0603  [C0603]
C41  33uF  CPOL-USSMCD  [SMC_D]
C42  0.01uF  C-USC0603  [C0603]
C43  22uF  CPOL-US153CLV-0605  [153CLV-0605]
D24  POLYZEN  [POLYZEN]
D25  SCHOTTKY  [SMA]
L2  WE-CBF_1812  [1812]
L3  CD54  [CD54]
R49  43K  R-US_R0603  [R0603]
R50  18K 1%  R-US_R0603  [R0603]
R51  2.43K 1%  R-US_R0603  [R0603]
U7  FAN8303  [SO-8]

### Nets
+5V: C41.+ L3.P$1 R50.1 ; also sheet 1,2,3,5
+12V: L2.2 ; also sheet 5
GND: C40.1 C41.- C42.1 C43.- D24.P$2(GND) D25.A R51.2 U7.4(GND) ; also sheet 1,2,3,5
N$800: R50.2 R51.1 U7.5(FB)
N$900: C39.2 U7.1(BS)
N$1000: C39.1 D25.C L3.P$2 U7.3(SW)
N$1100: C40.2 R49.2
N$1200: R49.1 U7.6(COMP)
N$1300: C42.2 U7.8(SS)
N$1500: D24.P$1(IN) L2.1
SAFE12V: C43.+ D24.P$3(OUT) U7.2(VIN) ; also sheet 2
Unconnected: U7.7(EN)

### Notes on the sheet
- autosportlabs.com
- RaceCapture/Pro
- Copyright 2008-2013 Autosport Labs
- G

## Sheet 5 of 5
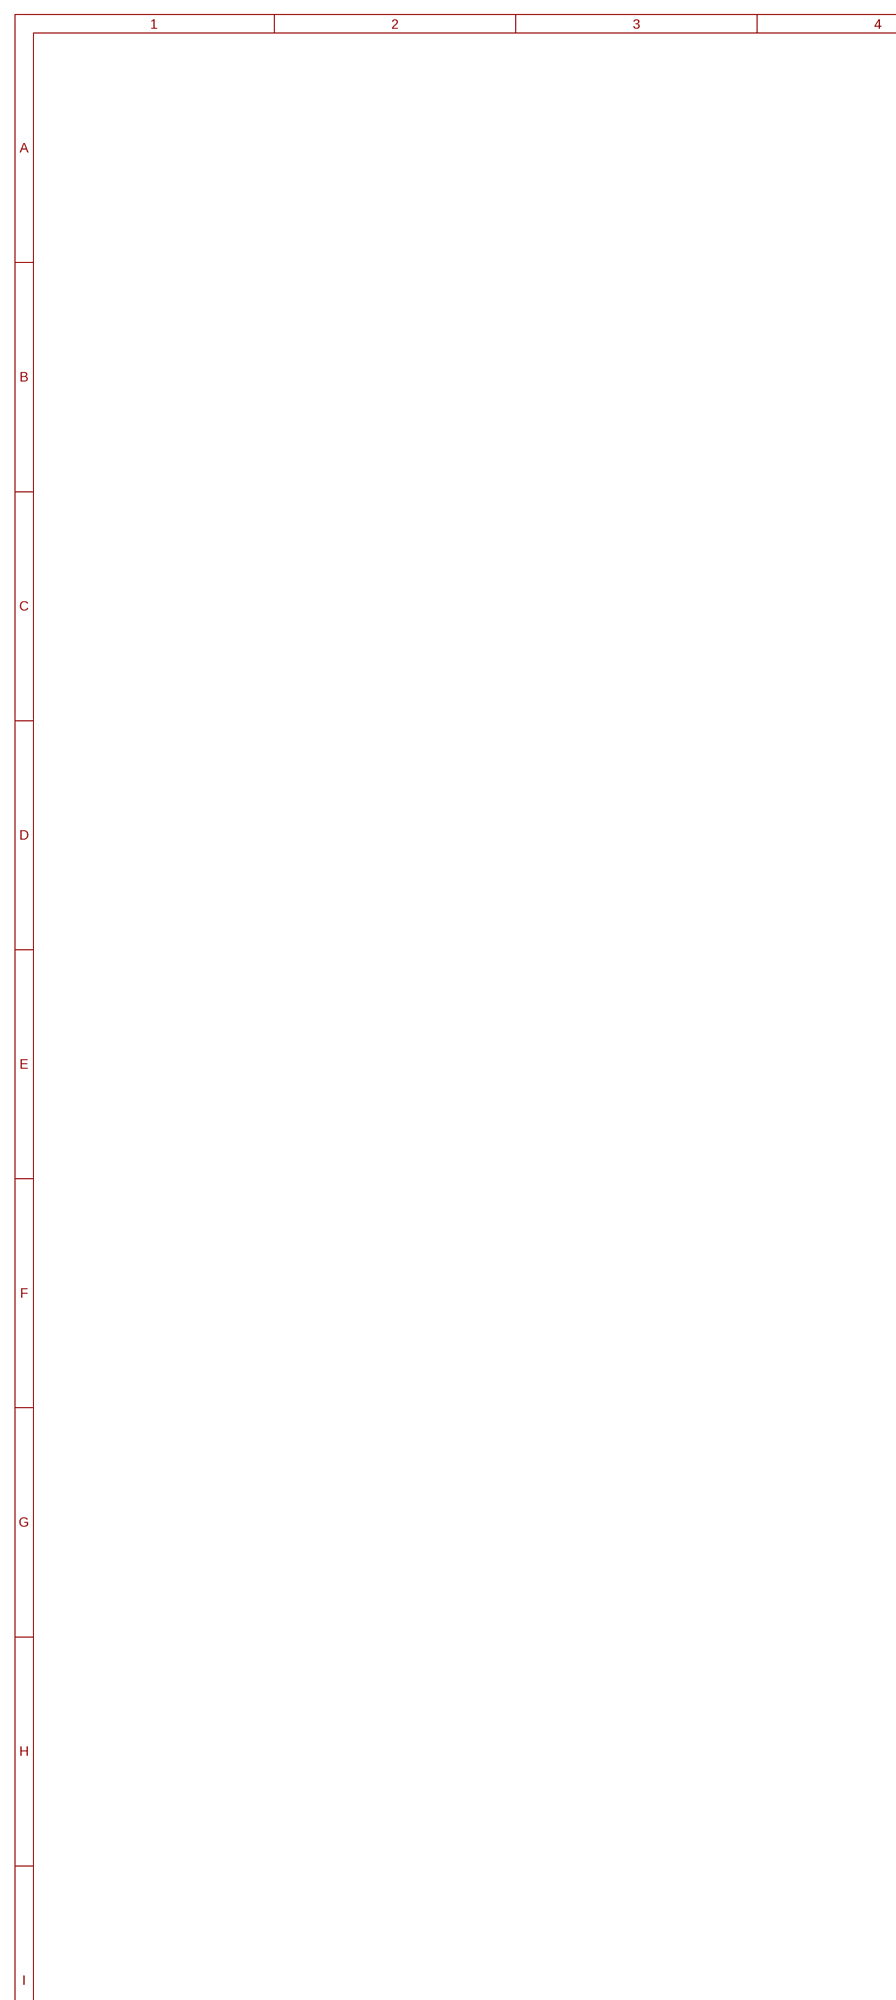
[diagram p8: schematic, sheet 5, part 1 of 2]
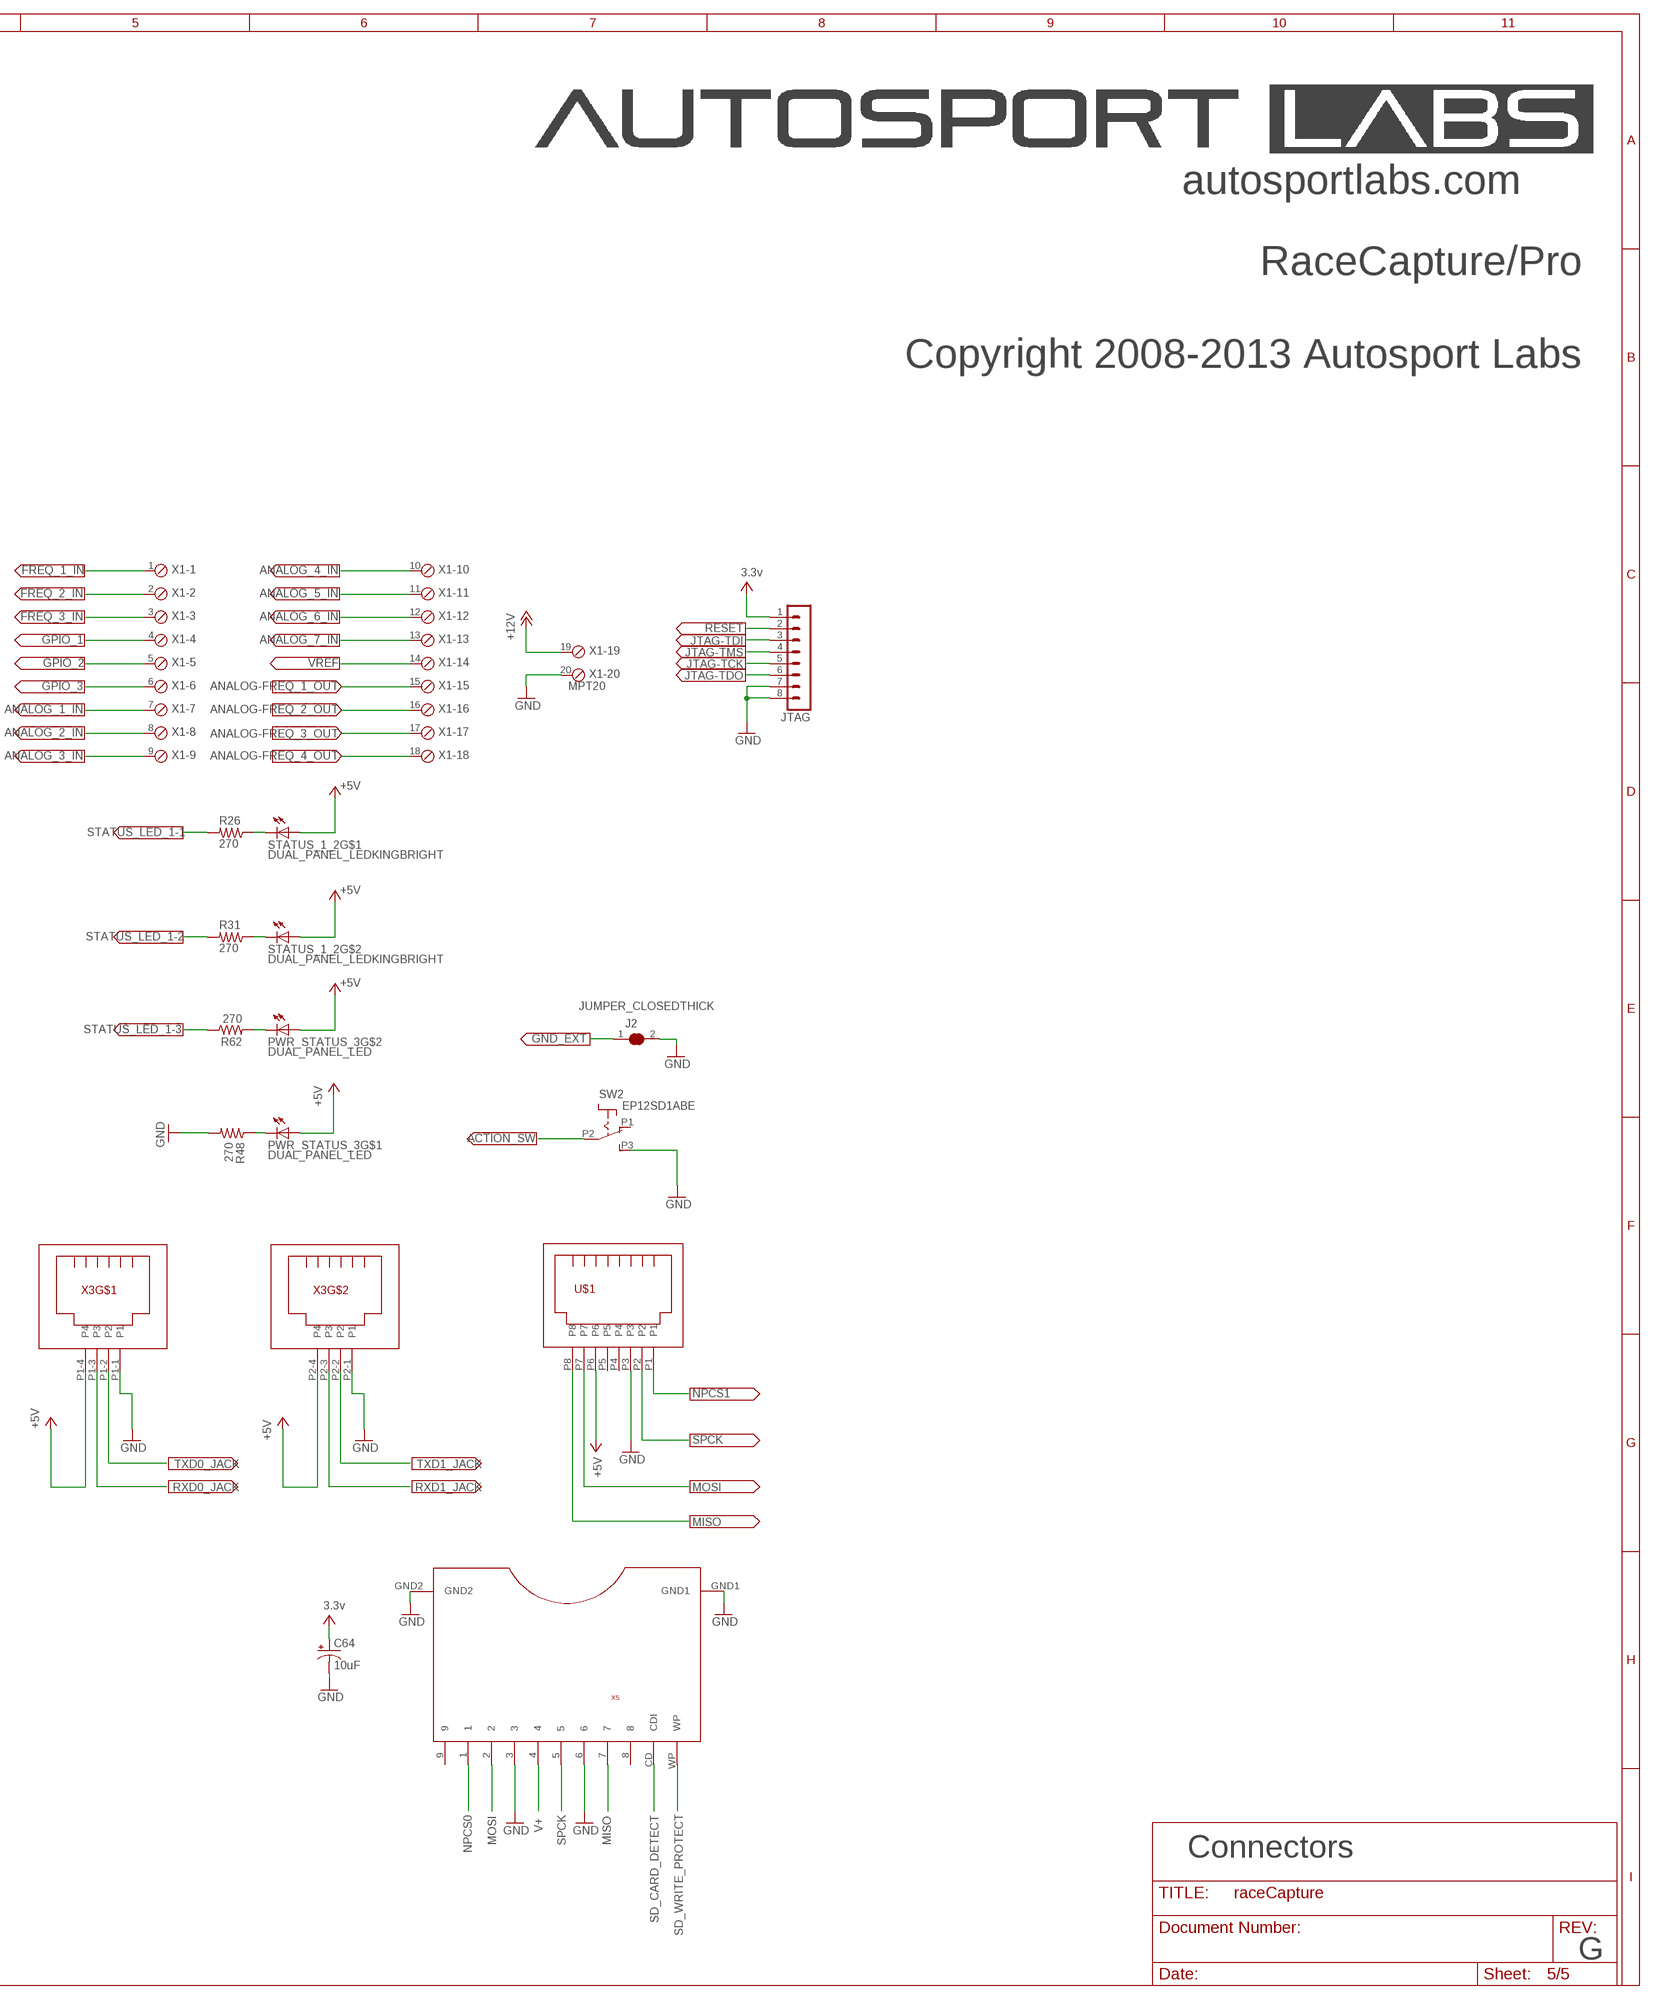
[diagram p9: schematic, sheet 5, part 2 of 2]

### Parts
C64  10uF  CPOL-USSMCA  [SMC_A]
J2  JUMPER_CLOSEDTHICK  [JUMPER_CLOSED_THICK]
JTAG  MA08-1  [MA08-1]
PWR_STATUS_3  DUAL_PANEL_LED  [DUAL_PANEL_LED]
R26  270  R-US_R0603  [R0603]
R31  270  R-US_R0603  [R0603]
R48  270  R-US_R0603  [R0603]
R62  270  R-US_R0603  [R0603]
STATUS_1_2  DUAL_PANEL_LEDKINGBRIGHT  [DUAL_PANEL_LED_KINGBRIGHT]
SW2  EP12SD1ABE  [EP12SD1ABE]
U$1  RJ45_RIGHT_ANGLEMOLEX_95001-2881  [RJ45_RIGHT_ANGLE_MOLEX_95001-2881]
X1  MPT20  [20POL35]
X3  GENERIC_DUAL_RJ11  [DUAL_RJ11_RIGHT_ANGLE_PCB]
X5  CARD_CONNECTOR_SDFCI  [FCI_SD_CARD]

### Nets
+5V: PWR_STATUS_3.1(A) PWR_STATUS_3.3(A) STATUS_1_2.1(A) STATUS_1_2.3(A) U$1.P6 X3.P1-4(P4) X3.P2-4(P4) ; also sheet 1,2,3,4
+12V: X1.19 ; also sheet 4
ACTION_SW: SW2.P2(P) ; also sheet 3
ANALOG-FREQ_1_OUT: X1.15 ; also sheet 1
ANALOG-FREQ_2_OUT: X1.16 ; also sheet 1
ANALOG-FREQ_3_OUT: X1.17 ; also sheet 1
ANALOG-FREQ_4_OUT: X1.18 ; also sheet 1
ANALOG_1_IN: X1.7 ; also sheet 2
ANALOG_2_IN: X1.8 ; also sheet 2
ANALOG_3_IN: X1.9 ; also sheet 2
ANALOG_4_IN: X1.10 ; also sheet 2
ANALOG_5_IN: X1.11 ; also sheet 2
ANALOG_6_IN: X1.12 ; also sheet 2
ANALOG_7_IN: X1.13 ; also sheet 2
FREQ_1_IN: X1.1 ; also sheet 1
FREQ_2_IN: X1.2 ; also sheet 1
FREQ_3_IN: X1.3 ; also sheet 1
GND: C64.- J2.2 JTAG.7 JTAG.8 R48.2 SW2.P3(S) U$1.P3 X1.20 X3.P1-1(P1) X3.P2-1(P1) X5.3 X5.6 X5.GND1 X5.GND2 ; also sheet 1,2,3,4
GND_EXT: J2.1 ; also sheet 1,2
GPIO_1: X1.4 ; also sheet 1
GPIO_2: X1.5 ; also sheet 1
GPIO_3: X1.6 ; also sheet 1
JTAG-TCK: JTAG.5 ; also sheet 3
JTAG-TDI: JTAG.3 ; also sheet 3
JTAG-TDO: JTAG.6 ; also sheet 3
JTAG-TMS: JTAG.4 ; also sheet 3
MISO: U$1.P8 X5.7 ; also sheet 1,3
MOSI: U$1.P7 X5.2 ; also sheet 1,3
N$2: PWR_STATUS_3.4(C) R62.2
N$7: R26.1 STATUS_1_2.2(C)
N$9: R31.1 STATUS_1_2.4(C)
N$22: PWR_STATUS_3.2(C) R48.1
NPCS0: X5.1 ; also sheet 3
NPCS1: U$1.P1 ; also sheet 3
RESET: JTAG.2 ; also sheet 3
RXD0_JACK: X3.P1-3(P3) ; also sheet 1
RXD1_JACK: X3.P2-3(P3) ; also sheet 1
SD_CARD_DETECT: X5.CD(CDI) ; also sheet 3
SD_WRITE_PROTECT: X5.WP ; also sheet 3
SPCK: U$1.P2 X5.5 ; also sheet 1,3
STATUS_LED_1-1: R26.2 ; also sheet 3
STATUS_LED_1-2: R31.2 ; also sheet 3
STATUS_LED_1-3: R62.1 ; also sheet 3
TXD0_JACK: X3.P1-2(P2) ; also sheet 1
TXD1_JACK: X3.P2-2(P2) ; also sheet 1
V+: C64.+ JTAG.1 X5.4 ; supply symbol labelled 3.3v ; also sheet 1,3
VREF: X1.14 ; also sheet 1
Unconnected: SW2.P1(O) U$1.P4 U$1.P5 X5.8 X5.9

### Notes on the sheet
- autosportlabs.com
- RaceCapture/Pro
- Copyright 2008-2013 Autosport Labs
- Connectors
- G

## Library data of the parts
C9 C25 C30 C33-C37 C39 C40 C42 C45-C56 C58-C63 C65-C68 = rcl:C-US: CAPACITOR, American symbol
C38 C41 C43 C44 C57 C64 = rcl:CPOL-US: POLARIZED CAPACITOR, American symbol
CN1-CN3 = cap_array:CAP_ARRAY_4
D24 = polyzen:POLYZEN
D25 D26 = smt_diodes:SCHOTTKY
GPIO1-GPIO3 = jumper:JP2E: JUMPER
J2 = jumpers:JUMPER_CLOSED
JTAG = con-lstb:MA08-1: PIN HEADER; OC_FARNELL: unknown; OC_NEWARK: unknown
L1 = smt_inductors:INDUCTOR
L2 = wuerth-elektronik:WE-CBF: SMD EMI Suppression Ferrite Beads - excellent anti-EMI properties - low DCR - impedances till 3000 ohms - rated current up to 6 A
L3 = sumida_inductors:CD54
PWR_STATUS_3 STATUS_1_2 = LEDs:DUAL_PANEL_LED
Q1 = crystal_smd:ABM8X
Q4 = transistor-small-signal:BSS84: P-CHANNEL MOS FET
R1-R14 R17 R19 R22-R26 R28-R32 R36-R39 R42-R44 R47-R52 R54-R57 R62 = rcl:R-US_: RESISTOR, American symbol
RESET TEST = jumper:SJ: SMD solder JUMPER
RN1-RN5 = resistor-dil:4R-N: Array Chip Resistor Source: RS Component / Phycomp
SW1 = special:SW_DIP-4: DIP SWITCH
SW2 = misc_switch:EP12SD1ABE
SW3 SW4 = tactile_switch:6X3.5_TACT
U1-U3 = power_mosfets:ZXMS6004FF
U4 = kionix:KXR94
U5 U11 U13 = op_amps:TLV274
U6 = max232:HIN232A
U7 = voltage_regulators:FAN8303
U8 = mcp1700:MCP1700
U9 = atmel-arm:AT91SAM7S512/256/128/64/321: AT91SAM7S512/256/128/64/321 ARM7 Processor
U10 = ly330alh:LY330ALH
U12 U14-U16 = smt_diodes:PESDXS4UD
U17 = 74xx-us:74*14: Hex schmitt trigger INVERTER
U$1 = FCI_RJ12:RJ45_RIGHT_ANGLE
X1 = pluggable_terminal_blocks:MPT20
X3 = FCI_RJ12:GENERIC_DUAL_RJ11
X5 = SD_Card_connector:CARD_CONNECTOR_SD
X6 = cnkls_parts:MINI_USB_SHIELD